# EAGLE design M227X (EAGLE 6.6.0)
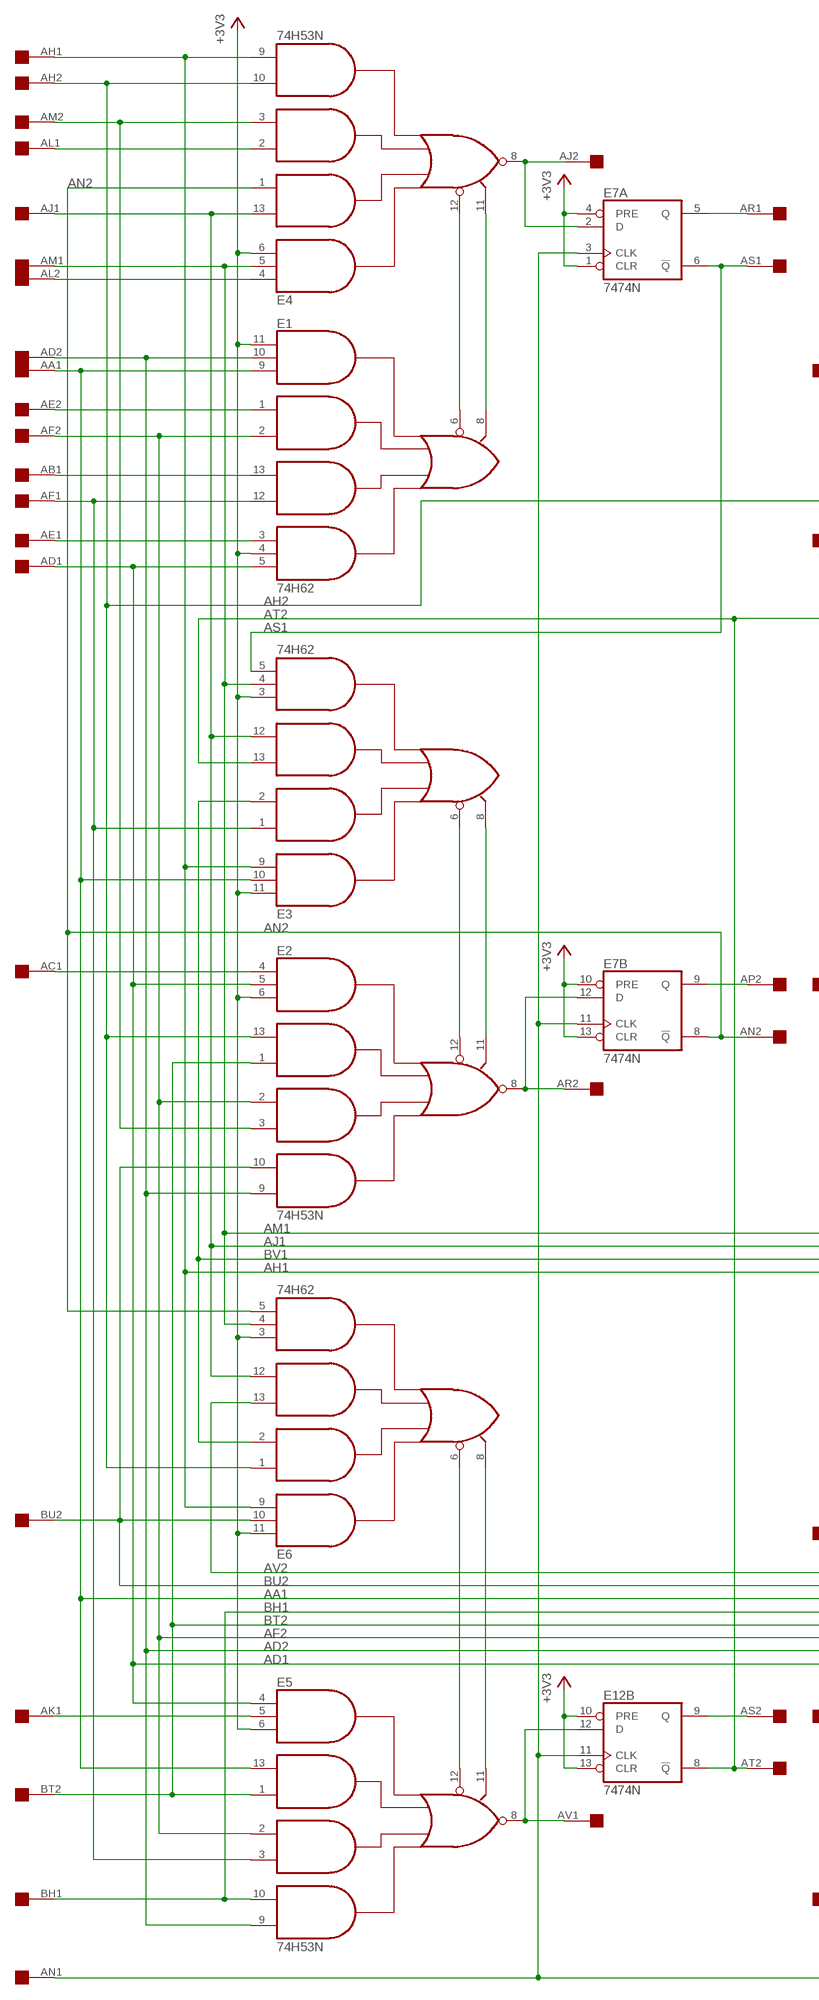
[diagram p0: schematic, sheet 1, part 1 of 2]
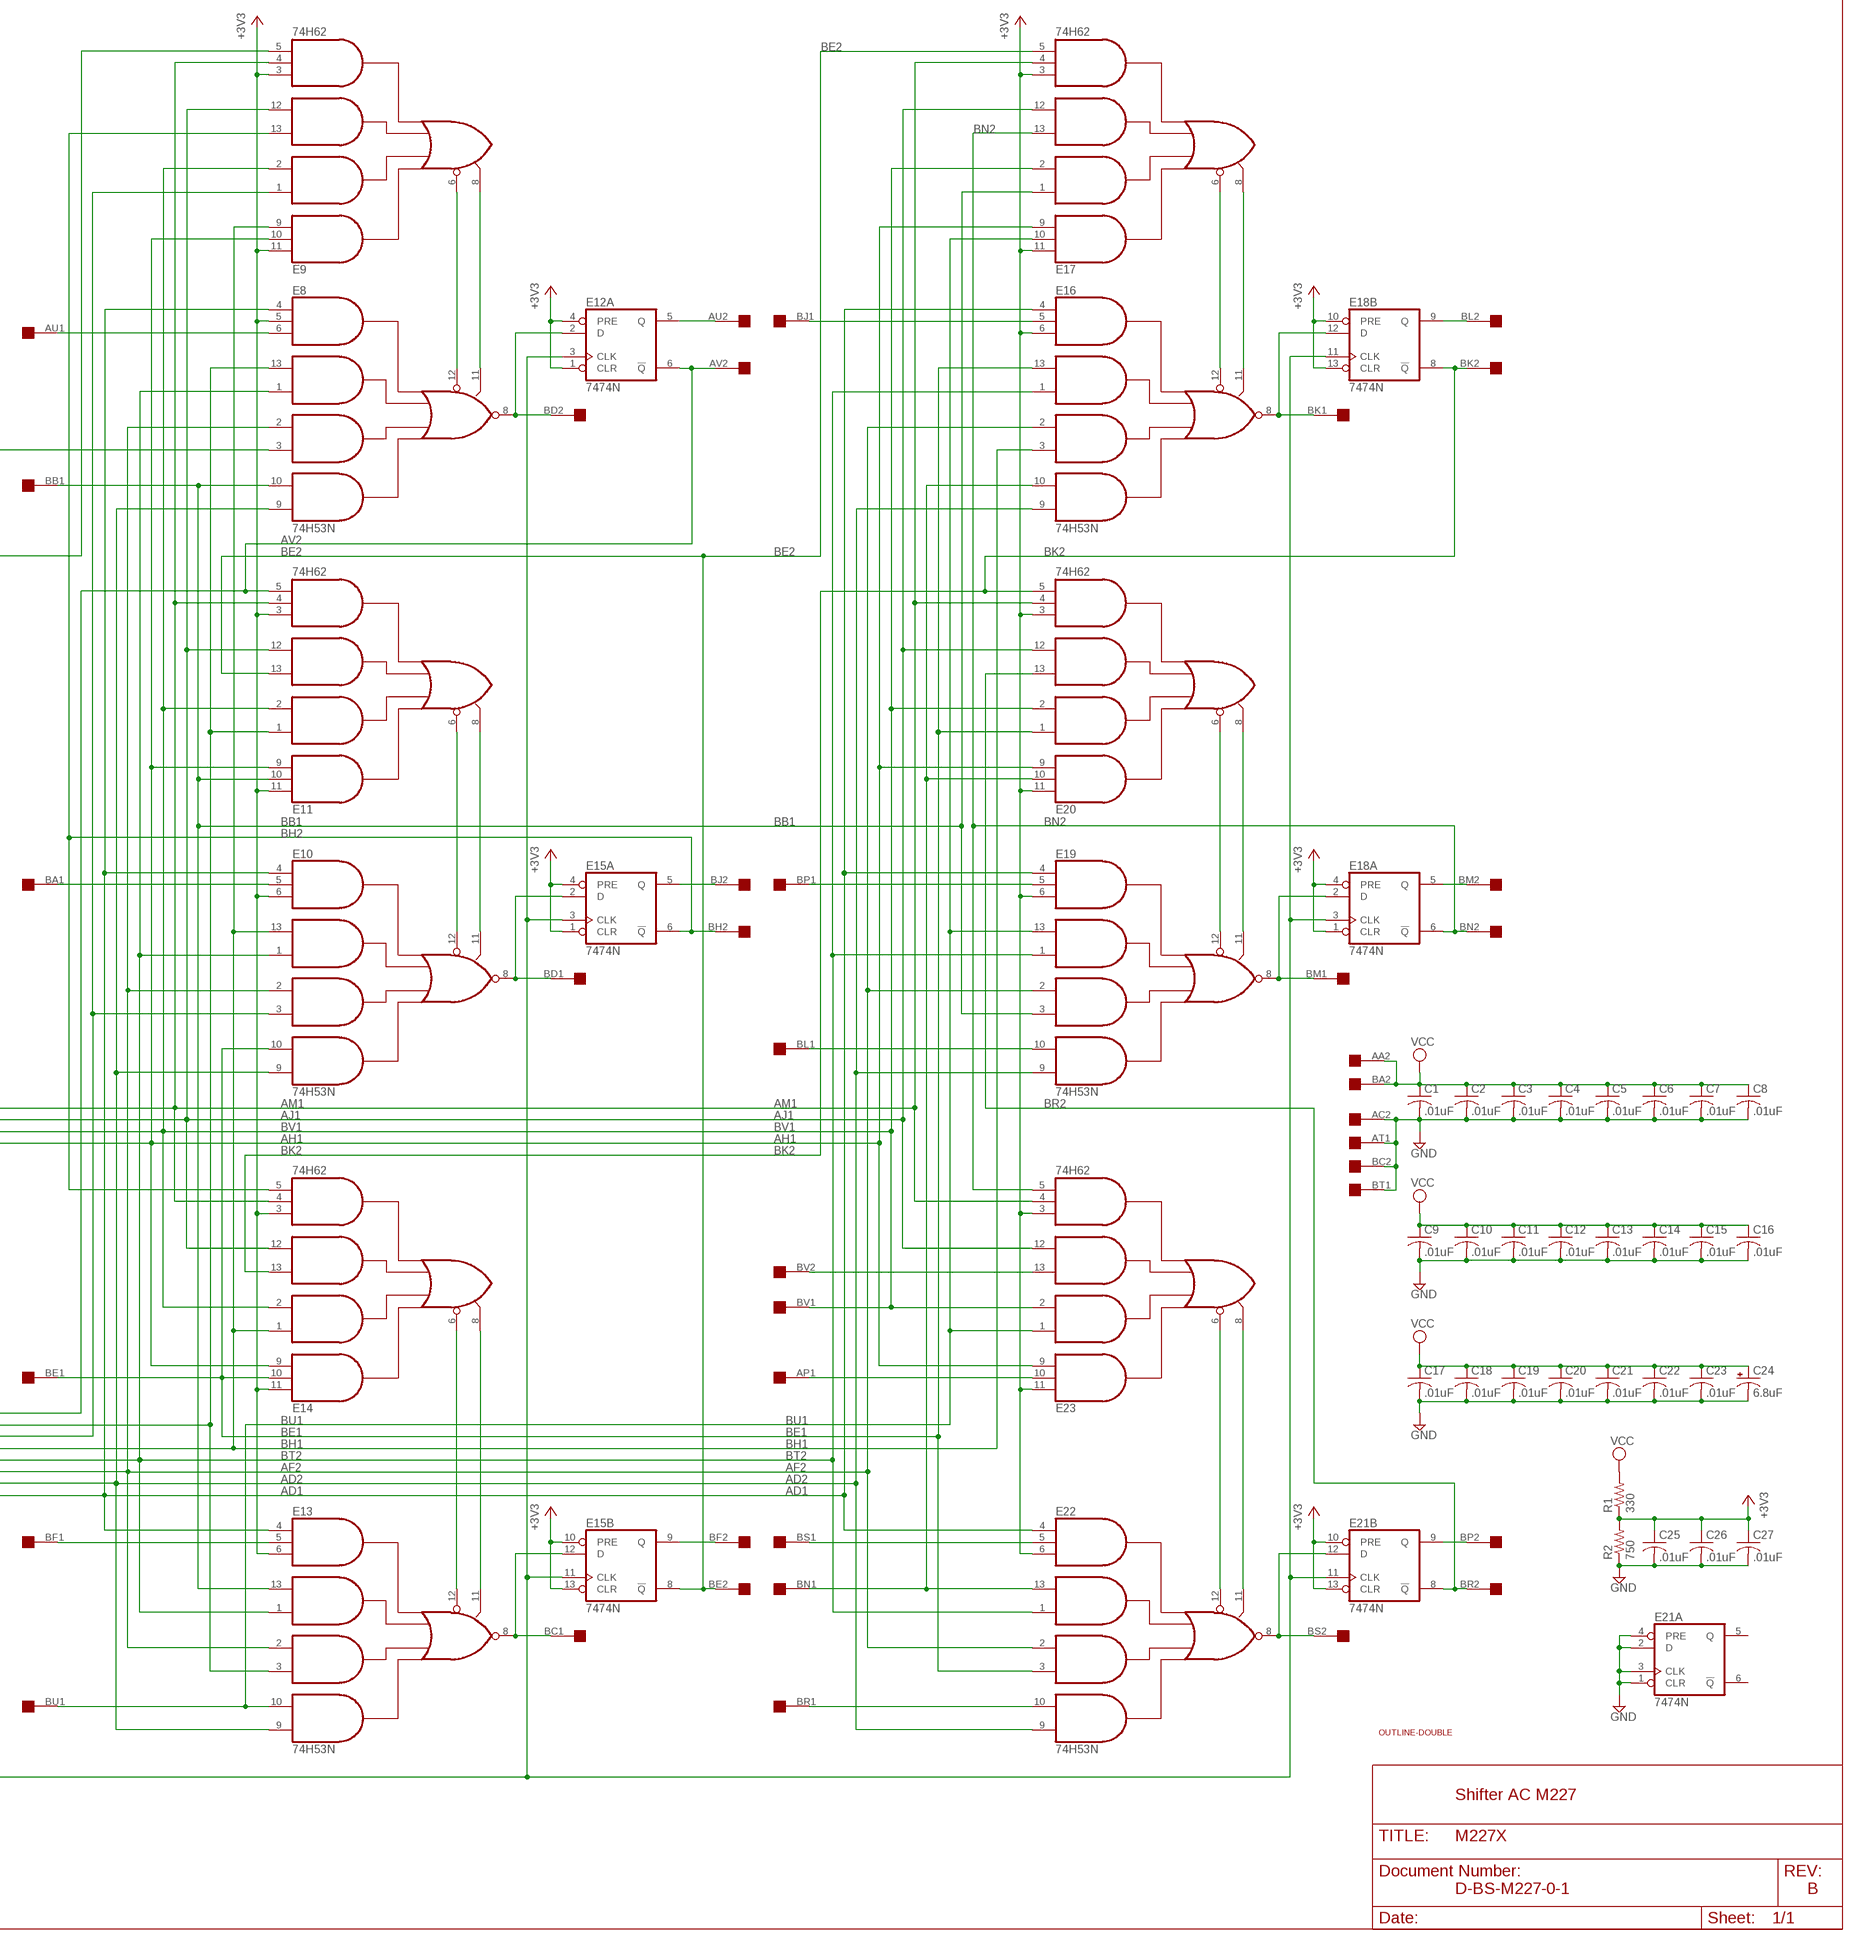
[diagram p1: schematic, sheet 1, part 2 of 2]

## Parts
C1  .01uF  C-US050-025X075  [C050-025X075]
C2  .01uF  C-US050-025X075  [C050-025X075]
C3  .01uF  C-US050-025X075  [C050-025X075]
C4  .01uF  C-US050-025X075  [C050-025X075]
C5  .01uF  C-US050-025X075  [C050-025X075]
C6  .01uF  C-US050-025X075  [C050-025X075]
C7  .01uF  C-US050-025X075  [C050-025X075]
C8  .01uF  C-US050-025X075  [C050-025X075]
C9  .01uF  C-US050-025X075  [C050-025X075]
C10  .01uF  C-US050-025X075  [C050-025X075]
C11  .01uF  C-US050-025X075  [C050-025X075]
C12  .01uF  C-US050-025X075  [C050-025X075]
C13  .01uF  C-US050-025X075  [C050-025X075]
C14  .01uF  C-US050-025X075  [C050-025X075]
C15  .01uF  C-US050-025X075  [C050-025X075]
C16  .01uF  C-US050-025X075  [C050-025X075]
C17  .01uF  C-US050-025X075  [C050-025X075]
C18  .01uF  C-US050-025X075  [C050-025X075]
C19  .01uF  C-US050-025X075  [C050-025X075]
C20  .01uF  C-US050-025X075  [C050-025X075]
C21  .01uF  C-US050-025X075  [C050-025X075]
C22  .01uF  C-US050-025X075  [C050-025X075]
C23  .01uF  C-US050-025X075  [C050-025X075]
C24  6.8uF  CPOL-USE20-8AXIAL  [E12-8]
C25  .01uF  C-US050-025X075  [C050-025X075]
C26  .01uF  C-US050-025X075  [C050-025X075]
C27  .01uF  C-US050-025X075  [C050-025X075]
E1  74H62  7462  [DIL14]
E2  74H53N  [DIL14]
E3  74H62  7462  [DIL14]
E4  74H53N  [DIL14]
E5  74H53N  [DIL14]
E6  74H62  7462  [DIL14]
E7  7474N  74S74N  [DIL14]
E8  74H53N  [DIL14]
E9  74H62  7462  [DIL14]
E10  74H53N  [DIL14]
E11  74H62  7462  [DIL14]
E12  7474N  74S74N  [DIL14]
E13  74H53N  [DIL14]
E14  74H62  7462  [DIL14]
E15  7474N  74S74N  [DIL14]
E16  74H53N  [DIL14]
E17  74H62  7462  [DIL14]
E18  7474N  74S74N  [DIL14]
E19  74H53N  [DIL14]
E20  74H62  7462  [DIL14]
E21  7474N  74S74N  [DIL14]
E22  74H53N  [DIL14]
E23  74H62  7462  [DIL14]
R1  330  R-US_0207/10  [0207/10]
R2  750  R-US_0207/10  [0207/10]
U$1  OUTLINE-DOUBLE  [DOUBLE]
U$3  DOUBLE  [EDGE-CON4]

## Nets
+3V3 [supply]: C25.1 C26.1 C27.1 E1.4(I9) E1.11(I1) E2.6(I2) E3.3(I8) E3.11(I1) E4.6(I2) E5.6(I2) E6.3(I8) E6.11(I1) E7.1(A:CLR) E7.4(A:PRE) E7.10(B:PRE) E7.13(B:CLR) E8.5(I11) E9.3(I8) E9.11(I1) E10.6(I2) E11.3(I8) E11.11(I1) E12.1(A:CLR) E12.4(A:PRE) E12.10(B:PRE) E12.13(B:CLR) E13.6(I2) E14.3(I8) E14.11(I1) E15.1(A:CLR) E15.4(A:PRE) E15.10(B:PRE) E15.13(B:CLR) E16.6(I2) E17.3(I8) E17.11(I1) E18.1(A:CLR) E18.4(A:PRE) E18.10(B:PRE) E18.13(B:CLR) E19.6(I2) E20.3(I8) E20.11(I1) E21.10(B:PRE) E21.13(B:CLR) E22.6(I2) E23.3(I8) E23.11(I1) R1.1 R2.2
AA1: E1.9(I3) E3.10(I2) E5.13(I3) E9.1(I4) E10.3(I6) U$3.AA1
AB1: E1.13(I6) U$3.AB1
AC1: E2.4(I1) U$3.AC1
AD1: E1.5(I10) E2.5(I11) E5.4(I1) E8.4(I1) E10.4(I1) E13.4(I1) E16.4(I1) E19.4(I1) E22.4(I1) U$3.AD1
AD2: E1.10(I2) E2.9(I8) E5.9(I8) E8.9(I8) E10.9(I8) E13.9(I8) E16.9(I8) E19.9(I8) E22.9(I8) U$3.AD2
AE1: E1.3(I8) U$3.AE1
AE2: E1.1(I4) U$3.AE2
AF1: E1.12(I7) E3.1(I4) E5.3(I6) U$3.AF1
AF2: E1.2(I5) E2.2(I5) E5.2(I5) E8.2(I5) E10.2(I5) E13.2(I5) E16.2(I5) E19.2(I5) E22.2(I5) U$3.AF2
AH1: E3.9(I3) E4.9(I8) E6.9(I3) E9.10(I2) E11.9(I3) E14.9(I3) E17.9(I3) E20.9(I3) E23.9(I3) U$3.AH1
AH2: E2.13(I3) E4.10(I7) E6.1(I4) E8.3(I6) U$3.AH2
AJ1: E3.12(I7) E4.13(I3) E6.12(I7) E9.12(I7) E11.12(I7) E14.12(I7) E17.12(I7) E20.12(I7) E23.12(I7) U$3.AJ1
AJ2: E4.8(O) E7.2(A:D) U$3.AJ2
AK1: E5.5(I11) U$3.AK1
AL1: E4.2(I5) U$3.AL1
AL2: E4.4(I1) U$3.AL2
AM1: E3.4(I9) E4.5(I11) E6.4(I9) E9.4(I9) E11.4(I9) E14.4(I9) E17.4(I9) E20.4(I9) E23.4(I9) U$3.AM1
AM2: E2.3(I6) E4.3(I6) U$3.AM2
AN1: E7.3(A:CLK) E7.11(B:CLK) E12.3(A:CLK) E12.11(B:CLK) E15.3(A:CLK) E15.11(B:CLK) E18.3(A:CLK) E18.11(B:CLK) E21.11(B:CLK) U$3.AN1
AN2: E4.1(I4) E6.5(I10) E7.8(B:!Q) U$3.AN2
AP1: E23.10(I2) U$3.AP1
AP2: E7.9(B:Q) U$3.AP2
AR1: E7.5(A:Q) U$3.AR1
AR2: E2.8(O) E7.12(B:D) U$3.AR2
AS1: E3.5(I10) E7.6(A:!Q) U$3.AS1
AS2: E12.9(B:Q) U$3.AS2
AT2: E3.13(I6) E9.5(I10) E12.8(B:!Q) U$3.AT2
AU1: E8.6(I2) U$3.AU1
AU2: E12.5(A:Q) U$3.AU2
AV1: E5.8(O) E12.12(B:D) U$3.AV1
AV2: E6.13(I6) E11.5(I10) E12.6(A:!Q) U$3.AV2
BA1: E10.5(I11) U$3.BA1
BB1: E8.10(I7) E11.10(I2) E13.13(I3) E17.1(I4) E19.3(I6) U$3.BB1
BC1: E13.8(O) E15.12(B:D) U$3.BC1
BD1: E10.8(O) E15.2(A:D) U$3.BD1
BD2: E8.8(O) E12.2(A:D) U$3.BD2
BE1: E10.10(I7) E14.10(I2) E16.13(I3) E20.1(I4) E22.3(I6) U$3.BE1
BE2: E11.13(I6) E15.8(B:!Q) E17.5(I10) U$3.BE2
BF1: E13.5(I11) U$3.BF1
BF2: E15.9(B:Q) U$3.BF2
BH1: E5.10(I7) E9.9(I3) E10.13(I3) E14.1(I4) E16.3(I6) U$3.BH1
BH2: E9.13(I6) E14.5(I10) E15.6(A:!Q) U$3.BH2
BJ1: E16.5(I11) U$3.BJ1
BJ2: E15.5(A:Q) U$3.BJ2
BK1: E16.8(O) E18.12(B:D) U$3.BK1
BK2: E14.13(I6) E18.8(B:!Q) E20.5(I10) U$3.BK2
BL1: E19.10(I7) U$3.BL1
BL2: E18.9(B:Q) U$3.BL2
BM1: E18.2(A:D) E19.8(O) U$3.BM1
BM2: E18.5(A:Q) U$3.BM2
BN1: E16.10(I7) E20.10(I2) E22.13(I3) U$3.BN1
BN2: E17.13(I6) E18.6(A:!Q) E23.5(I10) U$3.BN2
BP1: E19.5(I11) U$3.BP1
BP2: E21.9(B:Q) U$3.BP2
BR1: E22.10(I7) U$3.BR1
BR2: E20.13(I6) E21.8(B:!Q) U$3.BR2
BS1: E22.5(I11) U$3.BS1
BS2: E21.12(B:D) E22.8(O) U$3.BS2
BT2: E2.1(I4) E5.1(I4) E8.1(I4) E10.1(I4) E13.1(I4) E16.1(I4) E19.1(I4) E22.1(I4) U$3.BT2
BU1: E13.10(I7) E17.10(I2) E19.13(I3) E23.1(I4) U$3.BU1
BU2: E2.10(I7) E6.10(I2) E8.13(I3) E11.1(I4) E13.3(I6) U$3.BU2
BV1: E3.2(I5) E6.2(I5) E9.2(I5) E11.2(I5) E14.2(I5) E17.2(I5) E20.2(I5) E23.2(I5) U$3.BV1
BV2: E23.13(I6) U$3.BV2
GND [supply]: C1.2 C2.2 C3.2 C4.2 C5.2 C6.2 C7.2 C8.2 C9.2 C10.2 C11.2 C12.2 C13.2 C14.2 C15.2 C16.2 C17.2 C18.2 C19.2 C20.2 C21.2 C22.2 C23.2 C24.- C25.2 C26.2 C27.2 E21.1(A:CLR) E21.2(A:D) E21.3(A:CLK) E21.4(A:PRE) R2.1 U$3.AC2 U$3.AT1 U$3.BC2 U$3.BT1
N$1: E5.12(I9) E6.6(E0)
N$2: E5.11(I10) E6.8(E1)
N$3: E2.12(I9) E3.6(E0)
N$4: E2.11(I10) E3.8(E1)
N$5: E1.6(E0) E4.12(I9)
N$6: E1.8(E1) E4.11(I10)
N$14: E22.12(I9) E23.6(E0)
N$16: E13.12(I9) E14.6(E0)
N$17: E13.11(I10) E14.8(E1)
N$18: E10.12(I9) E11.6(E0)
N$19: E10.11(I10) E11.8(E1)
N$20: E8.12(I9) E9.6(E0)
N$21: E8.11(I10) E9.8(E1)
N$22: E16.11(I10) E17.8(E1)
N$23: E16.12(I9) E17.6(E0)
N$24: E19.12(I9) E20.6(E0)
N$25: E19.11(I10) E20.8(E1)
N$27: E22.11(I10) E23.8(E1)
VCC [supply]: C1.1 C2.1 C3.1 C4.1 C5.1 C6.1 C7.1 C8.1 C9.1 C10.1 C11.1 C12.1 C13.1 C14.1 C15.1 C16.1 C17.1 C18.1 C19.1 C20.1 C21.1 C22.1 C23.1 C24.+ R1.2 U$3.AA2 U$3.BA2
Unconnected: E21.5(A:Q) E21.6(A:!Q) U$3.AB2 U$3.AK2 U$3.BB2

## Notes on the sheet
- Shifter AC M227
- D-BS-M227-0-1 | B

## Power pins joined to a net without a drawn wire
GND: E1.7(GND) E2.7(GND) E3.7(GND) E4.7(GND) E5.7(GND) E6.7(GND) E7.7(P:GND) E8.7(GND) E9.7(GND) E10.7(GND) E11.7(GND) E12.7(P:GND) E13.7(GND) E14.7(GND) E15.7(P:GND) E16.7(GND) E17.7(GND) E18.7(P:GND) E19.7(GND) E20.7(GND) E21.7(P:GND) E22.7(GND) E23.7(GND)
VCC: E1.14(VCC) E2.14(VCC) E3.14(VCC) E4.14(VCC) E5.14(VCC) E6.14(VCC) E7.14(P:VCC) E8.14(VCC) E9.14(VCC) E10.14(VCC) E11.14(VCC) E12.14(P:VCC) E13.14(VCC) E14.14(VCC) E15.14(P:VCC) E16.14(VCC) E17.14(VCC) E18.14(P:VCC) E19.14(VCC) E20.14(VCC) E21.14(P:VCC) E22.14(VCC) E23.14(VCC)

## Library data of the parts
C1-C23 C25-C27 = rcl:C-US: CAPACITOR, American symbol
C24 = dec-con:CPOL-USE20-8AXIAL: A 0.8 inch electrolytic.
E1 E3 E6 E9 E11 E14 E17 E20 E23 = dec-con:74*62: 3-2-2-3 Gate Expander
E2 E4 E5 E8 E10 E13 E16 E19 E22 = dec-con:74H53N: 2-2-2-3 Input And-Or-Invert Gate
E7 E12 E15 E18 E21 = 74xx-us:74*74: Dual D type positive edge triggered FLIP FLOP, preset and clear
R1 R2 = rcl:R-US_: RESISTOR, American symbol
U$1 = dec-con:OUTLINE-*: Board outlines for DEC boards.
U$3 = dec-con:DOUBLE: Double-Height DEC board

## Net classes
1 supply: width 0.813 mm

## Board
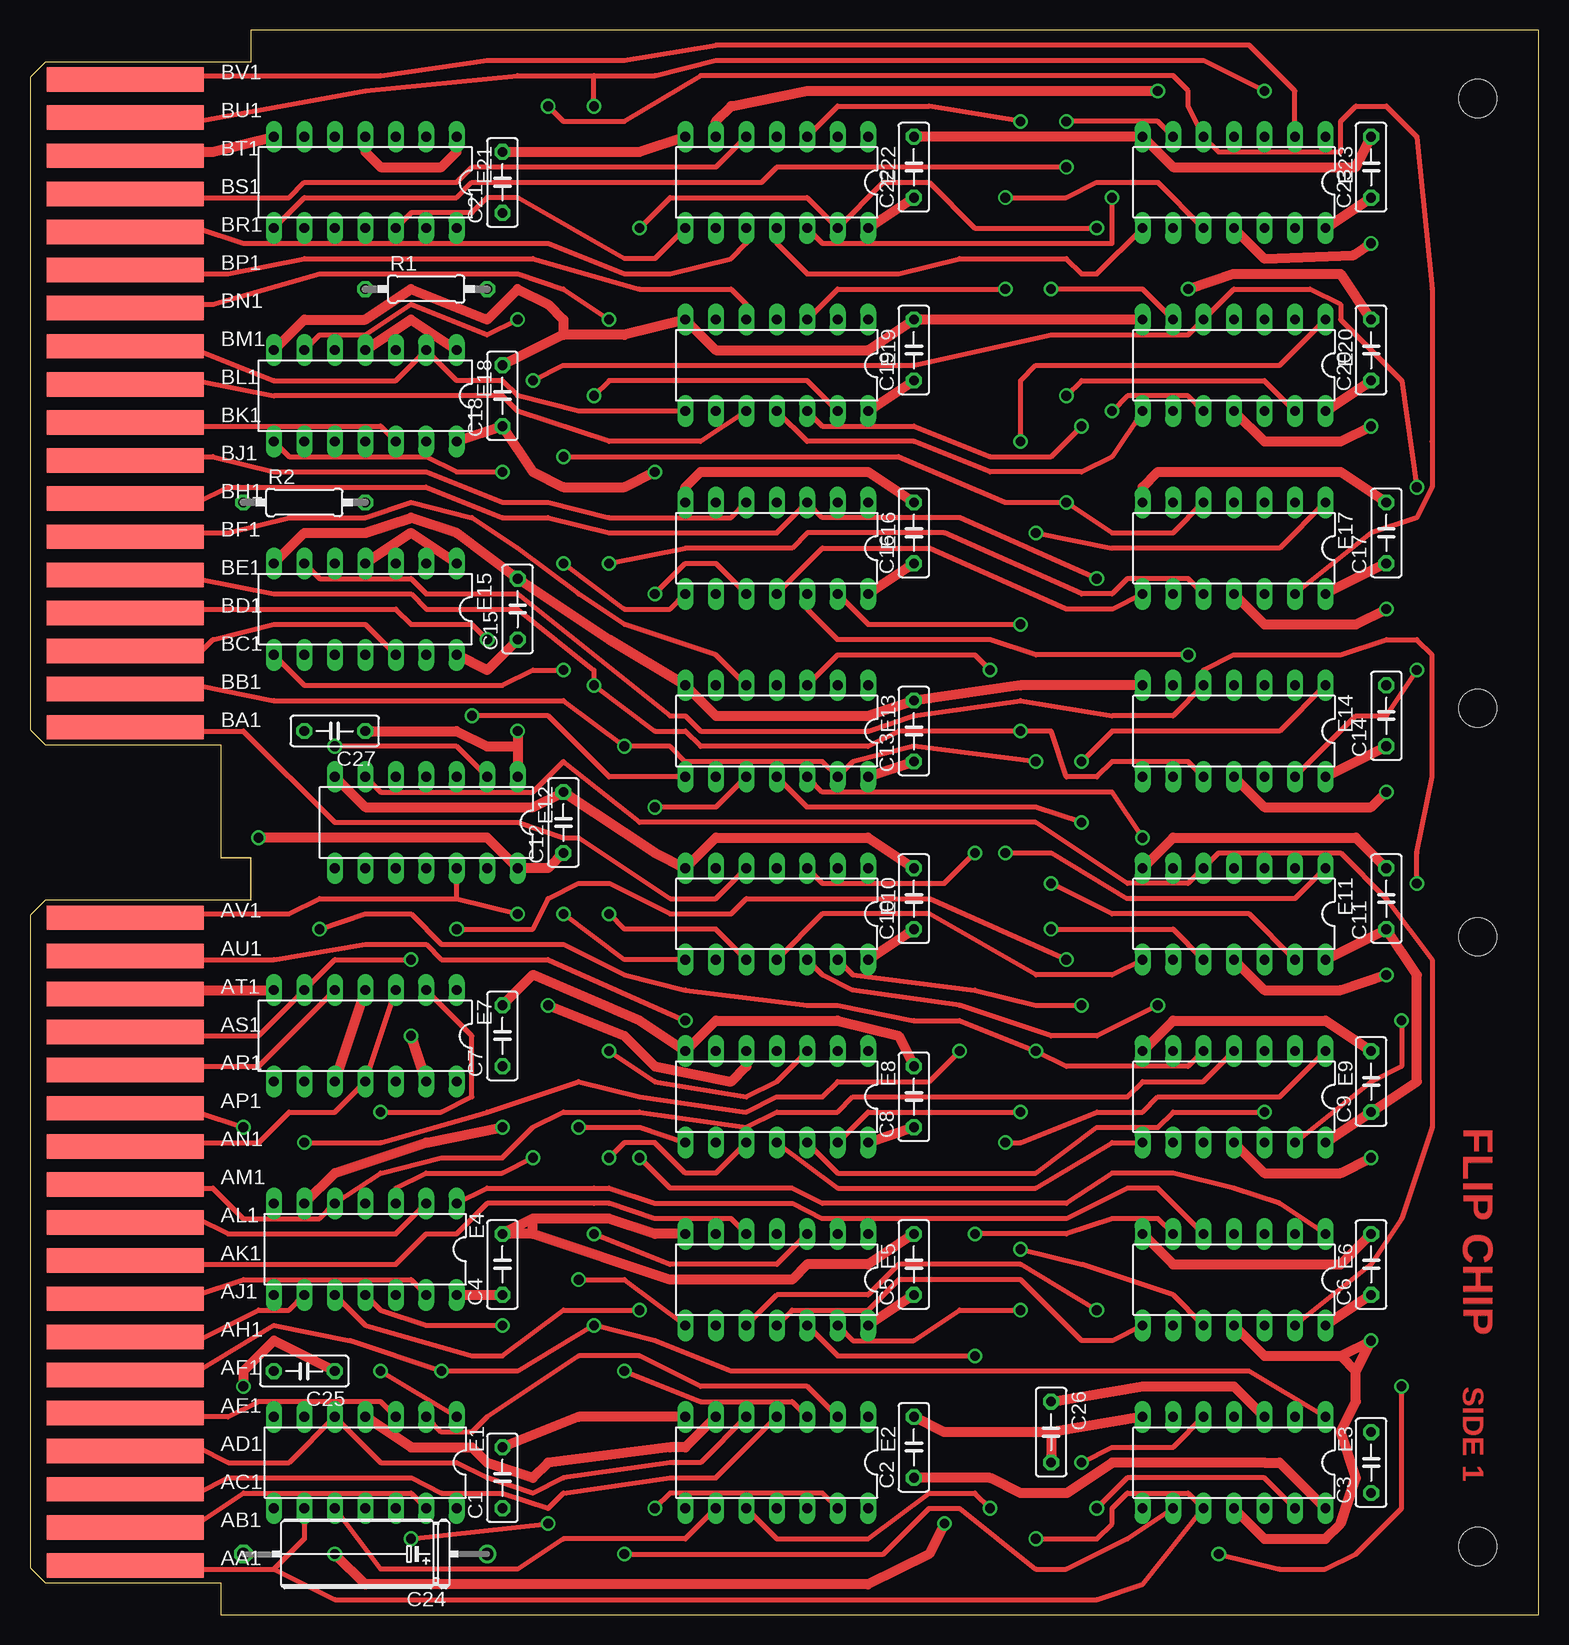
[diagram p2: board, top side]
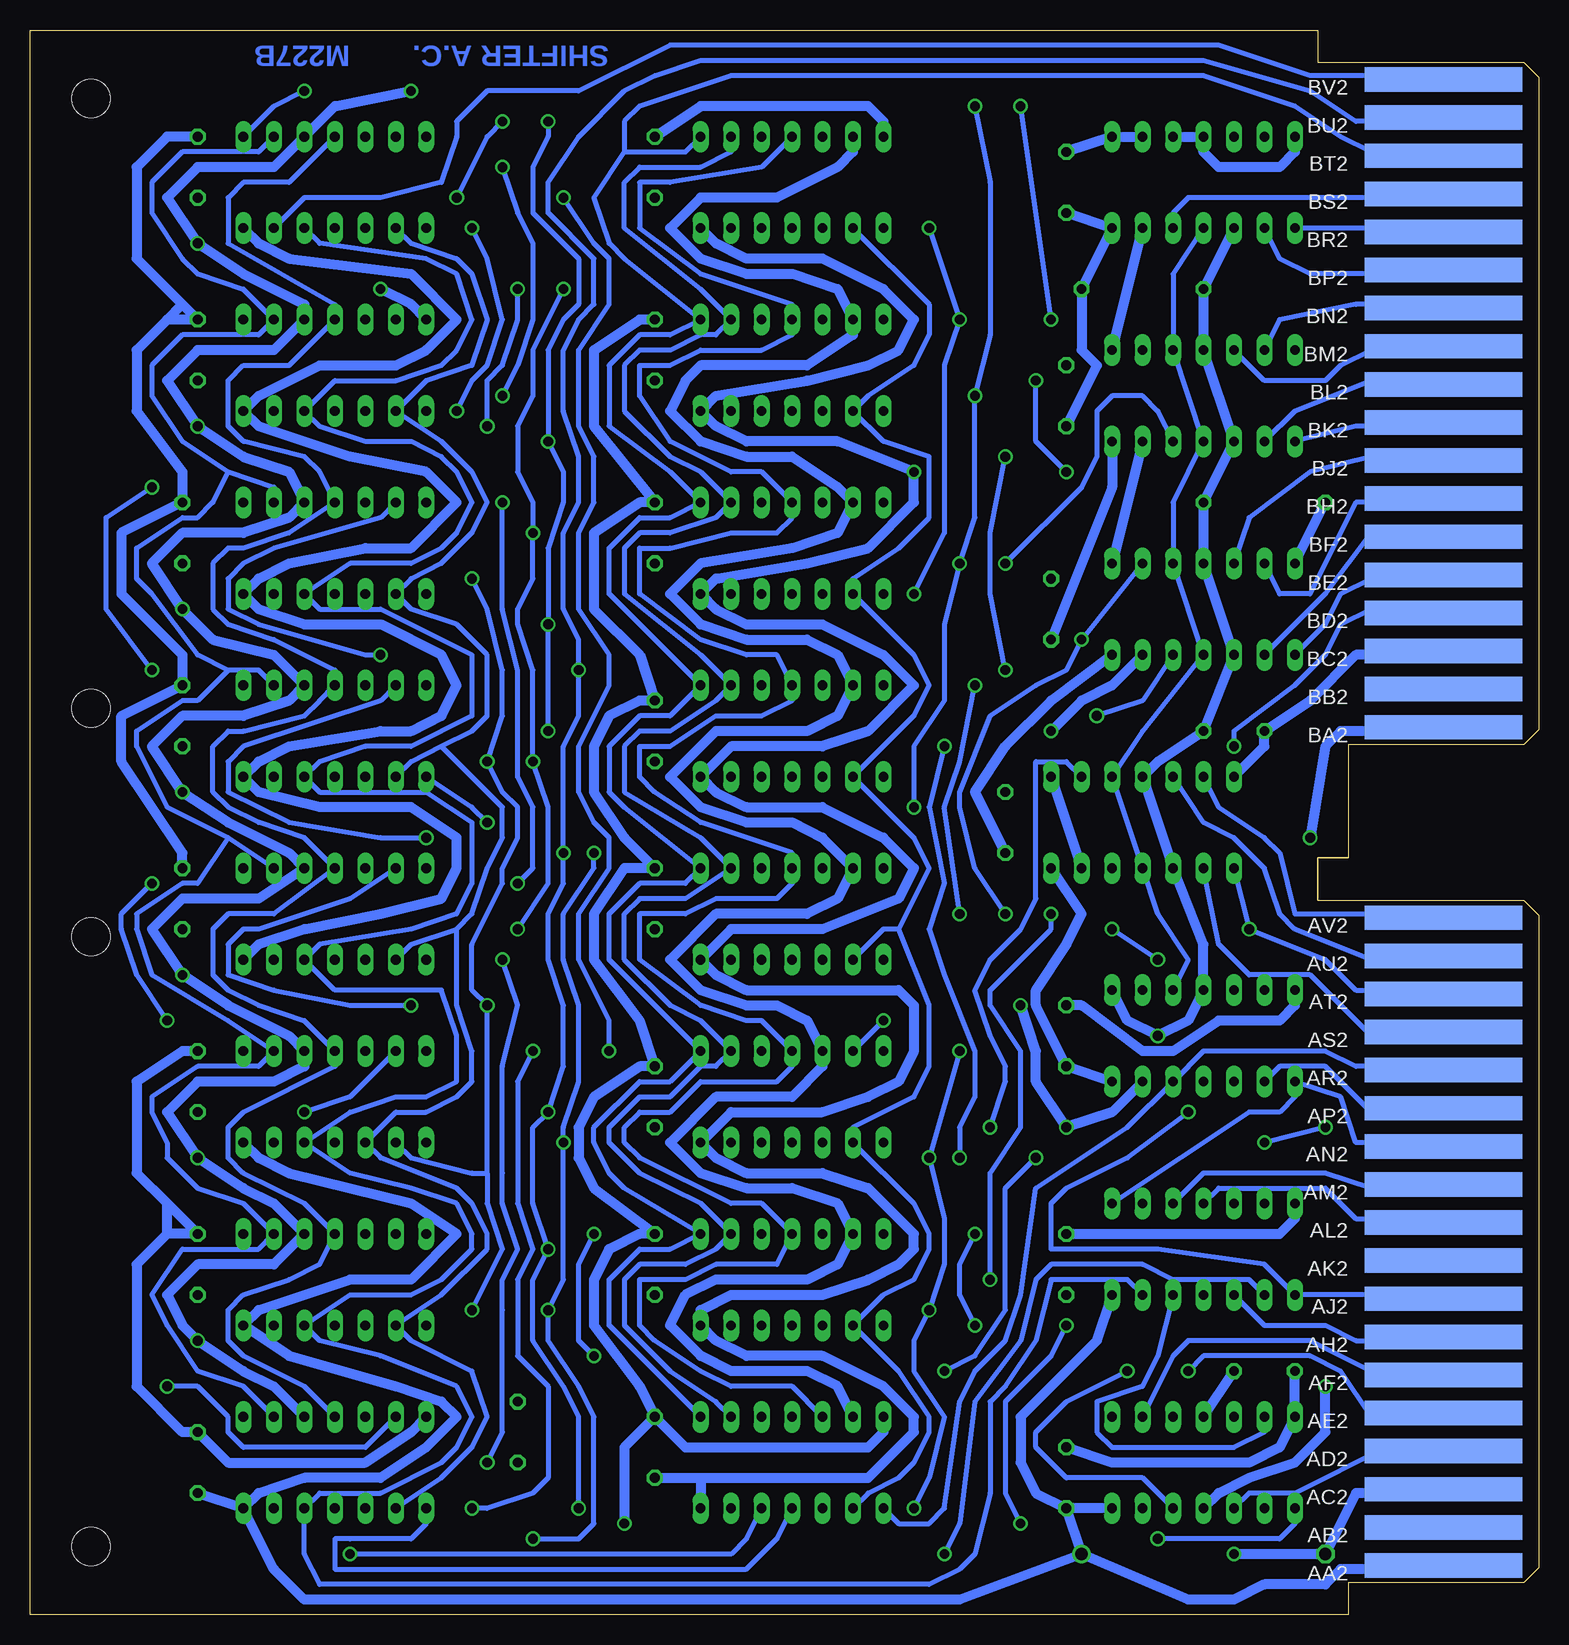
[diagram p3: board, bottom side, seen from below]

Size 125.73 x 132.08 mm. Coordinates in mm from the lower left corner, seen from the top.
Copper layers (1+16): Top 0.035mm / dielectric 1.5mm / Bottom 0.035mm
Design rules "16mils": minimum track width 16mil, minimum drill 32mil, track to track 15mil, track to pad 10mil, pad to pad 10mil, via to via 10mil, smd to smd 10mil, copper to edge 13mil, drill to drill 10mil, minimum pad ring 10mil, minimum via ring 8mil, stop-mask expansion 0mil, vias tented up to drill 0mil, thermal gap 10mil

### Footprints (pad centres in the part's own frame; a part is rotated, then mirrored left to right if it is on the bottom)
C050-025X075 = drill 0.813 octagon: 1 -2.54,0; 2 2.54,0
E12-8 = drill 1.016: + -10.16,0 | drill 1.016 octagon: - 10.16,0
DIL14 = drill 0.813 long: 1 -7.62,-3.81; 2 -5.08,-3.81; 3 -2.54,-3.81; 4 0,-3.81; 5 2.54,-3.81; 6 5.08,-3.81; 7 7.62,-3.81; 8 7.62,3.81; 9 5.08,3.81; 10 2.54,3.81; 11 0,3.81; 12 -2.54,3.81; 13 -5.08,3.81; 14 -7.62,3.81
0207/10 = drill 0.813 octagon: 1 -5.08,0; 2 5.08,0
DOUBLE = hole 3.175: 120.65,56.515; 120.65,5.715; 120.65,75.565; 120.65,126.365
EDGE-CON4 = smd 13.106 x 2.032: AA1 7.938,4.128; AB1 7.938,7.303; AC1 7.938,10.477; AD1 7.938,13.652; AE1 7.938,16.828; AF1 7.938,20.003; AH1 7.938,23.177; AJ1 7.938,26.352; AK1 7.938,29.527; AL1 7.938,32.703; AM1 7.938,35.877; AN1 7.938,39.053; AP1 7.938,42.227; AR1 7.938,45.403; AS1 7.938,48.578; AT1 7.938,51.752; AU1 7.938,54.928; AV1 7.938,58.102; BA1 7.938,73.978; BB1 7.938,77.153; BC1 7.938,80.328; BD1 7.938,83.502; BE1 7.938,86.677; BF1 7.938,89.853; BH1 7.938,93.028; BJ1 7.938,96.203; BK1 7.938,99.377; BL1 7.938,102.552; BM1 7.938,105.728; BN1 7.938,108.903; BP1 7.938,112.078; BR1 7.938,115.252; BS1 7.938,118.427; BT1 7.938,121.603; BU1 7.938,124.778; BV1 7.938,127.953 | smd 13.106 x 2.032 bottom: AA2 7.938,4.128; AB2 7.938,7.303; AC2 7.938,10.477; AD2 7.938,13.652; AE2 7.938,16.828; AF2 7.938,20.003; AH2 7.938,23.177; AJ2 7.938,26.352; AK2 7.938,29.527; AL2 7.938,32.703; AM2 7.938,35.877; AN2 7.938,39.053; AP2 7.938,42.227; AR2 7.938,45.403; AS2 7.938,48.578; AT2 7.938,51.752; AU2 7.938,54.928; AV2 7.938,58.102; BA2 7.938,73.978; BB2 7.938,77.153; BC2 7.938,80.328; BD2 7.938,83.502; BE2 7.938,86.677; BF2 7.938,89.853; BH2 7.938,93.028; BJ2 7.938,96.203; BK2 7.938,99.377; BL2 7.938,102.552; BM2 7.938,105.728; BN2 7.938,108.903; BP2 7.938,112.078; BR2 7.938,115.252; BS2 7.938,118.427; BT2 7.938,121.603; BU2 7.938,124.778; BV2 7.938,127.953

### Placement (x,y rotation side)
C1  39.37,11.43 90 top
C2  73.66,13.97 90 top
C3  111.76,12.7 90 top
C4  39.37,29.21 90 top
C5  73.66,29.21 90 top
C6  111.76,29.21 90 top
C7  39.37,48.26 90 top
C8  73.66,43.18 90 top
C9  111.76,44.45 90 top
C10  73.66,59.69 90 top
C11  113.03,59.69 90 top
C12  44.45,66.04 90 top
C13  73.66,73.66 90 top
C14  113.03,74.93 90 top
C15  40.64,83.82 90 top
C16  73.66,90.17 90 top
C17  113.03,90.17 90 top
C18  39.37,101.6 90 top
C19  73.66,105.41 90 top
C20  111.76,105.41 90 top
C21  39.37,119.38 90 top
C22  73.66,120.65 90 top
C23  111.76,120.65 90 top
C24  27.94,5.08 180 top
C25  22.86,20.32 180 top
C26  85.09,15.24 270 top
C27  25.4,73.66 180 top
E1  27.94,12.7 180 top
E2  62.23,12.7 180 top
E3  100.33,12.7 180 top
E4  27.94,30.48 180 top
E5  62.23,27.94 180 top
E6  100.33,27.94 180 top
E7  27.94,48.26 180 top
E8  62.23,43.18 180 top
E9  100.33,43.18 180 top
E10  62.23,58.42 180 top
E11  100.33,58.42 180 top
E12  33.02,66.04 180 top
E13  62.23,73.66 180 top
E14  100.33,73.66 180 top
E15  27.94,83.82 180 top
E16  62.23,88.9 180 top
E17  100.33,88.9 180 top
E18  27.94,101.6 180 top
E19  62.23,104.14 180 top
E20  100.33,104.14 180 top
E21  27.94,119.38 180 top
E22  62.23,119.38 180 top
E23  100.33,119.38 180 top
R1  33.02,110.49 0 top
R2  22.86,92.71 0 top
U$1  0,0 0 top
U$3  0,0 0 top

### Tracks (layer width: path | path; a pad name or v marks a point on that pad's centre or on a via)
+3V3  (via drill 0.81)
  Top 0.813: E3.11 102.87,6.35 107.95,6.35 109.22,7.62 110.49,11.43 109.22,15.24 110.49,17.78 110.49,20.32 | 110.49,20.32 v111.76,22.86 109.22,21.59 | C25.1 20.32,22.86 17.78,20.32 v17.78,19.05 | E4.6 25.4,36.83 33.02,39.37 v39.37,40.64 | v43.18,50.8 49.53,48.26 52.07,45.72 58.42,44.45 59.69,45.72 E8.5 | v40.64,73.66 40.64,72.39 | 40.64,72.39 E12.1 | C27.1 35.56,73.66 38.1,72.39 40.64,72.39 | E15.4 31.75,90.17 E15.1 | E18.4 31.75,107.95 E18.1 | E22.6 57.15,124.46 58.42,125.73 64.77,127 v93.98,127 | C26.1 92.71,19.05 100.33,19.05 E3.3 | E6.11 102.87,21.59 109.22,21.59 | 109.22,21.59 110.49,20.32 | E9.11 102.87,36.83 109.22,36.83 v111.76,38.1 | E11.11 102.87,52.07 109.22,52.07 v113.03,53.34 | E14.11 102.87,67.31 111.76,67.31 v113.03,68.58 | E20.11 102.87,97.79 109.22,97.79 v111.76,99.06 | E17.11 102.87,82.55 110.49,82.55 v113.03,83.82 | E7.10 E7.4 | E7.13 v31.75,48.26 | E23.11 102.87,113.03 110.3,113.32 v111.76,114.3 | E1.4 31.75,13.97 36.83,13.97 38.1,12.7 41.91,11.43 43.18,12.7 53.34,13.97 54.61,13.97 E2.6
  Bottom 0.813: E1.11 26.67,10.16 24.13,11.43 20.32,12.7 17.78,15.24 v17.78,19.05 | E1.4 C25.1 | E7.1 34.29,49.53 v31.75,48.26 29.21,49.53 E7.4 27.94,55.88 E12.10 E12.4 31.75,71.12 C27.1 E15.10 E15.4 R2.2 E18.10 E18.4 R1.1 E21.10 | E2.6 58.42,19.05 60.96,20.32 67.31,20.32 69.85,21.59 72.39,24.13 71.12,26.67 68.58,27.94 60.96,27.94 58.42,29.21 E5.6 58.42,34.29 62.23,35.56 66.04,35.56 69.85,36.83 72.39,39.37 68.58,43.18 62.23,43.18 59.69,45.72 E8.5 60.96,49.53 63.5,50.8 66.04,50.8 69.85,52.07 72.39,54.61 68.58,58.42 60.96,58.42 58.42,59.69 E10.6 59.69,64.77 62.23,66.04 66.04,66.04 69.85,67.31 72.39,69.85 68.58,73.66 60.96,73.66 58.42,74.93 E13.6 58.42,80.01 60.96,81.28 66.04,81.28 69.85,82.55 72.39,85.09 69.85,87.63 62.23,88.9 58.42,90.17 E16.6 58.42,93.98 62.23,96.52 66.04,96.52 69.85,97.79 72.39,100.33 71.12,102.87 69.85,104.14 60.96,104.14 57.15,106.68 E19.6 58.42,110.49 62.23,111.76 66.04,111.76 69.85,113.03 72.39,115.57 69.85,118.11 63.5,118.11 58.42,120.65 57.15,121.92 E22.6 | E3.3 105.41,19.05 107.95,20.32 v111.76,22.86 113.03,24.13 114.3,26.67 111.76,29.21 105.41,29.21 E6.3 105.41,34.29 107.95,35.56 v111.76,38.1 114.3,41.91 111.76,44.45 105.41,44.45 102.87,45.72 E9.3 104.14,48.26 109.22,50.8 v113.03,53.34 115.57,57.15 113.03,59.69 106.68,59.69 E11.3 104.14,63.5 109.22,66.04 v113.03,68.58 115.57,72.39 113.03,74.93 107.95,74.93 104.14,76.2 E14.3 105.41,80.01 110.49,81.28 v113.03,83.82 115.57,87.63 113.03,90.17 107.95,90.17 104.14,91.44 E17.3 104.14,95.25 107.95,96.52 v111.76,99.06 114.3,102.87 111.76,105.41 105.41,105.41 E20.3 102.87,109.22 107.95,111.76 v111.76,114.3 114.3,118.11 111.76,120.65 105.41,120.65 E23.3 100.33,125.73 v93.98,127
  Bottom 0.813: E7.13 35.56,41.91 v39.37,40.64 41.91,44.45 41.91,46.99 v43.18,50.8 | E12.13 E12.1 | E15.13 35.56,77.47 38.1,76.2 v40.64,73.66 | E18.1 E21.13 | E18.13 E15.1
AA1  (via drill 0.81)
  Top 0.406: U$3.AA1 8.89,3.81 20.32,3.81 | 20.32,3.81 25.4,1.27 88.9,1.27 92.71,2.54 E3.10 96.52,10.16 91.44,10.16 90.17,8.89 90.17,7.62 88.9,6.35 v83.82,6.35 | E1.9 22.86,6.35 20.32,3.81 | E5.13 68.58,22.86 73.66,22.86 77.47,25.4 v82.55,25.4 | v81.28,39.37 82.55,39.37 88.9,41.91 92.71,41.91 93.98,43.18 104.14,43.18 E9.1 | v78.74,63.5 76.2,60.96 66.04,60.96 E10.3
  Bottom 0.406: v83.82,6.35 80.01,6.35 78.74,7.62 78.74,16.51 80.01,19.05 82.55,22.86 v82.55,25.4 81.28,27.94 v81.28,39.37 81.28,40.64 80.01,44.45 80.01,50.8 81.28,54.61 81.28,58.42 78.74,62.23 v78.74,63.5
AB1
  Top 0.406: U$3.AB1 10.16,7.62 13.97,7.62 17.78,10.16 31.75,10.16 E1.13
AC1
  Top 0.406: U$3.AC1 8.89,10.16 13.97,10.16 16.51,11.43 31.75,11.43 34.29,10.16 39.37,10.16 43.18,8.89 44.45,10.16 53.34,11.43 57.15,11.43 E2.4
AD1
  Top 0.406: U$3.AD1 8.89,13.97 13.97,13.97 16.51,12.7 21.59,12.7 E1.5 29.21,12.7 35.56,12.7 38.1,11.43 41.91,10.16 44.45,11.43 53.34,12.7 55.88,12.7 E2.5
  Bottom 0.406: E2.5 62.23,19.05 67.31,19.05 69.85,20.32 73.66,22.86 74.93,24.13 74.93,27.94 71.12,27.94 68.58,29.21 63.5,29.21 E5.4 64.77,34.29 67.31,34.29 74.93,38.1 76.2,39.37 76.2,40.64 74.93,41.91 72.39,41.91 69.85,44.45 63.5,44.45 62.23,45.72 E8.4 64.77,49.53 66.04,49.53 69.85,50.8 74.93,54.61 74.93,58.42 71.12,58.42 68.58,59.69 63.5,59.69 62.23,60.96 E10.4 62.23,63.5 69.85,66.04 73.66,68.58 74.93,69.85 74.93,72.39 72.39,72.39 68.58,74.93 64.77,74.93 62.23,76.2 E13.4 63.5,80.01 66.04,80.01 69.85,81.28 74.93,85.09 74.93,88.9 72.39,88.9 67.31,90.17 63.5,90.17 62.23,91.44 E16.4 64.77,95.25 67.31,95.25 72.39,97.79 74.93,101.6 74.93,104.14 72.39,104.14 69.85,105.41 64.77,105.41 62.23,106.68 E19.4 62.23,109.22 69.85,111.76 74.93,115.57 74.93,119.38 72.39,119.38 64.77,120.65 E22.4
AD2
  Top 0.406: E2.9 54.61,6.35 44.45,6.35 40.64,3.81 29.21,3.81 E1.10
  Bottom 0.406: U$3.AD2 10.16,13.97 12.7,13.97 20.32,10.16 24.13,10.16 E1.10 | E2.9 55.88,10.16 53.34,11.43 52.07,12.7 50.8,15.24 50.8,16.51 53.34,20.32 E5.9 54.61,26.67 52.07,27.94 50.8,30.48 50.8,31.75 52.07,34.29 E8.9 57.15,40.64 52.07,43.18 50.8,45.72 50.8,50.8 53.34,57.15 | E22.9 50.8,109.22 50.8,106.68 52.07,104.14 55.88,101.6 E19.9 54.61,97.79 50.8,96.52 50.8,91.44 53.34,88.9 57.15,86.36 E16.9 52.07,80.01 50.8,77.47 52.07,74.93 E13.9 52.07,64.77 50.8,62.23 53.34,57.15 | 53.34,57.15 54.61,57.15 E10.9
AE1
  Top 0.406: E1.3 29.21,17.78 19.05,17.78 16.51,16.51 8.89,16.51 U$3.AE1
AE2  (via drill 0.81)
  Top 0.406: v29.21,20.32 E1.1
  Bottom 0.406: U$3.AE2 10.16,16.51 13.97,16.51 16.51,20.32 19.05,21.59 27.94,21.59 v29.21,20.32
AF1  (via drill 0.81)
  Top 0.406: E3.1 101.6,20.32 58.42,20.32 52.07,22.86 v46.99,24.13 40.64,20.32 v34.29,20.32 26.67,22.86 20.32,24.13 13.97,20.32 8.89,20.32 U$3.AF1 | v46.99,31.75 53.34,29.21 62.23,29.21 E5.3
  Bottom 0.406: E1.12 33.02,11.43 39.37,11.43 41.91,13.97 41.91,15.24 39.37,17.78 v34.29,20.32 | v46.99,24.13 48.26,26.67 48.26,29.21 v46.99,31.75
AF2
  Top 0.406: E2.2 64.77,19.05 55.88,19.05 50.8,21.59 45.72,21.59 38.1,16.51 36.83,15.24 34.29,15.24 E1.2
  Bottom 0.406: U$3.AF2 10.16,20.32 13.97,20.32 19.05,22.86 29.21,22.86 30.48,21.59 E1.2 | E2.2 68.58,17.78 72.39,20.32 76.2,24.13 76.2,27.94 74.93,29.21 71.12,29.21 68.58,30.48 E5.2 69.85,34.29 74.93,36.83 77.47,39.37 77.47,40.64 74.93,43.18 72.39,43.18 69.85,45.72 68.58,45.72 E8.2 69.85,49.53 72.39,50.8 76.2,54.61 76.2,58.42 74.93,59.69 71.12,59.69 E10.2 69.85,64.77 76.2,68.58 76.2,72.39 74.93,73.66 72.39,73.66 68.58,76.2 E13.2 69.85,80.01 76.2,85.09 76.2,88.9 74.93,90.17 72.39,90.17 68.58,91.44 E16.2 69.85,95.25 72.39,96.52 76.2,100.33 76.2,104.14 74.93,105.41 72.39,105.41 69.85,106.68 68.58,106.68 E19.2 69.85,110.49 76.2,115.57 76.2,119.38 74.93,120.65 69.85,120.65 67.31,121.92 E22.2
AH1  (via drill 0.81)
  Top 0.406: U$3.AH1 8.89,22.86 13.97,22.86 19.05,25.4 21.59,25.4 E4.9 | v49.53,5.08 71.12,5.08 74.93,8.89 77.47,8.89 83.82,3.81 86.36,3.81 91.44,6.35 E3.9
  Bottom 0.406: E4.9 24.13,27.94 30.48,27.94 33.02,29.21 40.64,29.21 41.91,27.94 43.18,22.86 46.99,17.78 48.26,7.62 v49.53,5.08 | E3.9 91.44,11.43 88.9,13.97 87.63,16.51 88.9,20.32 93.98,22.86 E6.9 91.44,26.67 87.63,30.48 87.63,31.75 88.9,34.29 90.17,35.56 96.52,38.1 E9.10 95.25,41.91 92.71,41.91 90.17,43.18 88.9,44.45 88.9,46.99 90.17,50.8 90.17,57.15 | E11.9 93.98,55.88 90.17,57.15 | 90.17,57.15 88.9,58.42 87.63,62.23 86.36,64.77 86.36,67.31 91.44,72.39 | 91.44,72.39 93.98,71.12 E14.9 | 91.44,72.39 88.9,73.66 87.63,74.93 87.63,80.01 90.17,82.55 93.98,83.82 E17.9 93.98,86.36 91.44,87.63 88.9,90.17 87.63,92.71 88.9,95.25 91.44,97.79 E20.9 92.71,102.87 88.9,104.14 87.63,107.95 88.9,111.76 90.17,113.03 93.98,114.3 E23.9
AH2  (via drill 0.81)
  Top 0.406: E4.10 27.94,24.13 36.83,21.59 39.37,21.59 44.45,25.4 v50.8,25.4 | v48.26,46.99 52.07,44.45 59.69,43.18 62.23,44.45 E8.3 | E2.13 66.04,10.16 53.34,10.16 v52.07,8.89 | E6.1 104.14,34.29 100.33,35.56 95.25,36.83 90.17,36.83 86.36,34.29 66.04,34.29 63.5,35.56 53.34,35.56 v50.8,38.1
  Bottom 0.406: E4.10 22.86,24.13 17.78,24.13 15.24,22.86 8.89,22.86 U$3.AH2 | v48.26,46.99 v50.8,38.1 49.53,33.02 49.53,29.21 v50.8,25.4 52.07,22.86 52.07,20.32 49.53,16.51 50.8,11.43 v52.07,8.89
AJ1
  Top 0.406: U$3.AJ1 8.89,26.67 13.97,26.67 17.78,27.94 31.75,27.94 E4.13
  Bottom 0.406: E4.13 34.29,27.94 40.64,27.94 41.91,22.86 44.45,19.05 45.72,17.78 45.72,10.16 46.99,5.08 48.26,3.81 50.8,2.54 101.6,2.54 102.87,5.08 E3.12 101.6,10.16 96.52,10.16 91.44,12.7 90.17,13.97 88.9,16.51 90.17,19.05 96.52,21.59 101.6,22.86 E6.12 99.06,26.67 93.98,26.67 91.44,27.94 88.9,30.48 88.9,31.75 90.17,34.29 93.98,35.56 99.06,36.83 E9.12 99.06,41.91 95.25,43.18 92.71,43.18 90.17,44.45 90.17,48.26 91.44,52.07 100.33,52.07 E11.12 101.6,55.88 93.98,57.15 90.17,58.42 88.9,60.96 88.9,66.04 92.71,68.58 101.6,68.58 E14.12 101.6,71.12 97.79,72.39 93.98,72.39 88.9,74.93 88.9,80.01 96.52,83.82 101.6,83.82 E17.12 99.06,87.63 93.98,87.63 91.44,88.9 90.17,90.17 88.9,92.71 90.17,95.25 91.44,96.52 93.98,97.79 97.79,97.79 101.6,99.06 E20.12 100.33,102.87 95.25,102.87 91.44,104.14 90.17,105.41 88.9,107.95 90.17,111.76 92.71,113.03 101.6,114.3 E23.12
AJ2  (via drill 0.81)
  Top 0.406: v29.21,41.91 34.29,41.91 36.83,43.18 36.83,48.26 E7.2
  Bottom 0.406: U$3.AJ2 10.16,26.67 E4.8 22.86,29.21 31.75,30.48 40.64,30.48 40.64,34.29 39.37,35.56 34.29,38.1 v29.21,41.91
AK1
  Top 0.406: U$3.AK1 8.89,29.21 30.48,29.21 33.02,31.75 35.56,31.75 38.1,34.29 46.99,34.29 48.26,34.29 52.07,33.02 58.42,33.02 E5.5
AL1
  Top 0.406: U$3.AL1 8.89,33.02 13.97,33.02 16.51,31.75 30.48,31.75 E4.2
AL2
  Bottom 0.406: E4.4 26.67,35.56 17.78,35.56 15.24,33.02 8.89,33.02 U$3.AL2
AM1
  Top 0.406: U$3.AM1 10.16,35.56 15.24,35.56 17.78,33.02 24.13,33.02 E4.5 29.21,36.83 34.29,38.1 39.37,38.1 41.91,40.64 44.45,41.91 50.8,41.91 59.69,40.64 62.23,41.91 67.31,41.91 68.58,43.18 91.44,43.18 92.71,44.45 97.79,44.45 E9.4
  Bottom 0.406: E3.4 102.87,19.05 107.95,21.59 109.22,22.86 109.22,25.4 107.95,26.67 104.14,27.94 101.6,29.21 E6.4 102.87,34.29 107.95,36.83 109.22,38.1 109.22,40.64 107.95,41.91 100.33,45.72 E9.4 102.87,49.53 106.68,50.8 109.22,52.07 110.49,53.34 110.49,57.15 109.22,58.42 105.41,58.42 E11.4 102.87,64.77 106.68,66.04 109.22,67.31 110.49,68.58 110.49,72.39 109.22,73.66 107.95,73.66 102.87,74.93 101.6,76.2 E14.4 100.33,78.74 105.41,81.28 109.22,82.55 110.49,83.82 110.49,87.63 109.22,88.9 107.95,88.9 104.14,90.17 E17.4 101.6,95.25 102.87,96.52 107.95,97.79 109.22,99.06 109.22,102.87 107.95,104.14 104.14,104.14 E20.4 100.33,109.22 109.22,114.3 109.22,118.11 107.95,119.38 104.14,119.38 E23.4
AM2  (via drill 0.81)
  Top 0.406: E4.3 30.48,35.56 33.02,36.83 39.37,36.83 v41.91,38.1 | v49.53,20.32 55.88,17.78 63.5,17.78 E2.3
  Bottom 0.406: U$3.AM2 8.89,35.56 13.97,35.56 17.78,36.83 27.94,36.83 E4.3 | v49.53,20.32 46.99,21.59 44.45,25.4 44.45,35.56 v41.91,38.1
AN1
  Top 0.406: U$3.AN1 8.89,39.37 19.05,39.37 21.59,41.91 25.4,41.91 E7.11 E7.3
  Bottom 0.406: E7.3 29.21,54.61 31.75,58.42 E12.11 E12.3 33.02,73.66 E15.11 E15.3 30.48,92.71 E18.11 E18.3 30.48,111.76 E21.11
AN2
  Top 0.406: E4.1 38.1,35.56 46.99,35.56 48.26,35.56 52.07,34.29 63.5,34.29 66.04,33.02 86.36,33.02 91.44,35.56 93.98,35.56 E6.5
  Bottom 0.406: U$3.AN2 8.89,39.37 15.24,39.37 16.51,43.18 E7.8 20.32,43.18 21.59,41.91 24.13,41.91 E4.1
AP1  (via drill 0.81)
  Top 0.406: U$3.AP1 8.89,41.91 13.97,41.91 v17.78,40.64 | v22.86,39.37 29.21,39.37 38.1,41.91 45.72,44.45 50.8,43.18 59.69,41.91 62.23,43.18 66.04,43.18 67.31,44.45 74.93,44.45 v77.47,46.99 | v81.28,118.11 86.36,118.11 88.9,119.38 93.98,119.38 E23.10
  Bottom 0.406: v17.78,40.64 v22.86,39.37 | v77.47,46.99 77.47,49.53 80.01,54.61 80.01,58.42 77.47,62.23 77.47,64.77 78.74,66.04 80.01,68.58 80.01,72.39 77.47,77.47 77.47,80.01 80.01,83.82 80.01,90.17 78.74,92.71 78.74,96.52 80.01,99.06 80.01,105.41 77.47,109.22 77.47,113.03 78.74,114.3 v81.28,118.11
AP2
  Bottom 0.406: U$3.AP2 8.89,41.91 13.97,41.91 17.78,45.72 21.59,45.72 E7.9
AR1
  Top 0.406: U$3.AR1 10.16,45.72 19.05,45.72 E7.5
AR2
  Bottom 0.406: E2.8 53.34,7.62 50.8,7.62 49.53,8.89 48.26,17.78 46.99,20.32 44.45,22.86 43.18,26.67 41.91,35.56 34.29,40.64 E7.12 27.94,46.99 17.78,46.99 15.24,45.72 8.89,45.72 U$3.AR2
AS1  (via drill 0.81)
  Top 0.406: U$3.AS1 8.89,48.26 19.05,48.26 E7.6 25.4,54.61 v31.75,54.61 | v35.56,57.15 41.91,57.15 43.18,59.69 45.72,60.96 48.26,60.96 53.34,58.42 58.42,58.42 59.69,59.69 74.93,59.69 v86.36,54.61 | E3.5 95.25,13.97 90.17,13.97 v87.63,12.7
  Bottom 0.406: v31.75,54.61 v35.56,57.15 | v87.63,12.7 86.36,15.24 86.36,25.4 86.36,27.94 85.09,30.48 86.36,34.29 86.36,36.83 86.36,45.72 85.09,50.8 v86.36,54.61
AS2
  Bottom 0.406: U$3.AS2 10.16,48.26 13.97,48.26 19.05,53.34 24.13,53.34 26.67,55.88 E12.9
AT2  (via drill 0.81)
  Top 0.406: v24.13,57.15 27.94,58.42 31.75,58.42 34.29,55.88 44.45,55.88 49.53,53.34 54.61,52.07 64.77,50.8 67.31,50.8 73.66,49.53 77.47,49.53 v83.82,46.99 86.36,45.72 96.52,45.72 E9.5 | E3.13 102.87,11.43 91.44,11.43 v88.9,8.89
  Bottom 0.406: E12.8 v24.13,57.15 17.78,54.61 15.24,52.07 8.89,52.07 U$3.AT2 | v83.82,46.99 85.09,44.45 85.09,34.29 83.82,30.48 85.09,27.94 85.09,21.59 82.55,19.05 82.55,11.43 83.82,10.16 87.63,8.89 v88.9,8.89
AU1  (via drill 0.81)
  Top 0.406: U$3.AU1 10.16,54.61 20.32,54.61 27.94,55.88 33.02,55.88 34.29,54.61 43.18,54.61 v54.61,49.53
  Bottom 0.406: E8.6 v54.61,49.53
AU2
  Bottom 0.406: U$3.AU2 11.43,54.61 13.97,54.61 20.32,57.15 21.59,58.42 22.86,62.23 25.4,64.77 27.94,66.04 E12.5
AV1  (via drill 0.81)
  Top 0.406: U$3.AV1 8.89,58.42 21.59,58.42 24.13,59.69 35.56,59.69 | 35.56,59.69 E12.12 | 35.56,59.69 v40.64,58.42 | v45.72,27.94 49.53,27.94 E5.8
  Bottom 0.406: v45.72,27.94 45.72,36.83 43.18,40.64 43.18,46.99 45.72,50.8 45.72,52.07 40.64,57.15 v40.64,58.42
AV2
  Top 0.406: E6.13 111.76,29.21 114.3,33.02 116.84,40.64 116.84,54.61 113.03,59.69 109.22,63.5 99.06,63.5 E11.5 96.52,60.96 91.44,60.96 83.82,66.04 50.8,66.04 44.45,71.12 41.91,68.58 29.21,68.58 E12.6
  Bottom 0.406: E12.6 26.67,67.31 22.86,64.77 21.59,63.5 20.32,58.42 8.89,58.42 U$3.AV2
BA1
  Top 0.406: U$3.BA1 8.89,73.66 17.78,73.66 25.4,66.04 40.64,66.04 44.45,64.77 45.72,64.77 53.34,59.69 57.15,59.69 E10.5
BB1  (via drill 0.81)
  Top 0.406: E8.10 57.15,36.83 54.61,36.83 52.07,39.37 49.53,39.37 v48.26,38.1 | U$3.BB1 10.16,77.47 13.97,77.47 20.32,76.2 44.45,76.2 v49.53,72.39 53.34,72.39 54.61,71.12 66.04,71.12 E13.13 68.58,71.12 73.66,72.39 v83.82,71.12 | E11.10 95.25,57.15 v85.09,57.15 | v83.82,90.17 90.17,88.9 104.14,88.9 E17.1 | E19.3 67.31,110.49 v81.28,110.49
  Bottom 0.406: v49.53,72.39 50.8,67.31 49.53,60.96 50.8,57.15 49.53,53.34 46.99,46.99 46.99,43.18 48.26,40.64 v48.26,38.1 | v85.09,57.15 82.55,60.96 82.55,67.31 v83.82,71.12 83.82,78.74 85.09,82.55 85.09,83.82 83.82,86.36 v83.82,90.17 83.82,92.71 85.09,95.25 85.09,99.06 83.82,101.6 83.82,105.41 v81.28,110.49
BC1  (via drill 0.81)
  Top 0.406: E13.8 48.26,69.85 43.18,74.93 v36.83,74.93 | U$3.BC1 8.89,80.01 13.97,80.01 15.24,81.28 20.32,82.55 27.94,82.55 E15.12
  Bottom 0.406: E15.12 33.02,76.2 v36.83,74.93
BD1  (via drill 0.81)
  Top 0.406: E10.8 49.53,54.61 v44.45,58.42 | U$3.BD1 10.16,83.82 30.48,83.82 31.75,82.55 36.83,82.55 v38.1,81.28
  Bottom 0.406: v44.45,58.42 46.99,62.23 48.26,67.31 48.26,68.58 45.72,74.93 41.91,77.47 39.37,78.74 v38.1,81.28 E15.2
BD2  (via drill 0.81)
  Top 0.406: v45.72,40.64 50.8,40.64 E8.8 | E12.2 35.56,72.39 v25.4,72.39
  Bottom 0.406: U$3.BD2 10.16,83.82 13.97,83.82 16.51,82.55 17.78,80.01 20.32,77.47 25.4,73.66 v25.4,72.39 | v45.72,40.64 44.45,44.45 44.45,45.72 45.72,48.26 46.99,52.07 45.72,54.61 43.18,57.15 41.91,59.69 41.91,71.12 39.37,71.12 E12.2
BE1  (via drill 0.81)
  Top 0.406: U$3.BE1 10.16,86.36 13.97,86.36 20.32,85.09 31.75,85.09 33.02,83.82 40.64,83.82 46.99,78.74 v46.99,77.47 52.07,73.66 54.61,73.66 55.88,72.39 69.85,72.39 72.39,73.66 v82.55,73.66 85.09,73.66 86.36,69.85 88.9,69.85 90.17,71.12 96.52,71.12 E14.10 | E22.3 67.31,125.73 74.93,125.73 v82.55,124.46 | E10.10 57.15,57.15 49.53,57.15 v48.26,58.42 | v82.55,97.79 82.55,102.87 83.82,104.14 104.14,104.14 E20.1 | E16.13 69.85,82.55 v82.55,82.55
  Bottom 0.406: v82.55,124.46 82.55,123.19 83.82,120.65 83.82,116.84 80.01,113.03 80.01,109.22 81.28,107.95 82.55,105.41 v82.55,97.79 81.28,95.25 81.28,92.71 82.55,88.9 v82.55,82.55 v82.55,73.66 | v48.26,58.42 49.53,67.31 48.26,71.12 v46.99,77.47
BE2  (via drill 0.81)
  Top 0.406: E15.8 22.86,77.47 39.37,77.47 41.91,78.74 v44.45,78.74 | E11.13 101.6,58.42 90.17,58.42 v85.09,60.96 | E17.5 95.25,90.17 90.17,90.17 v86.36,92.71 81.28,92.71 72.39,96.52 v44.45,96.52
  Bottom 0.406: U$3.BE2 8.89,86.36 13.97,86.36 16.51,85.09 17.78,82.55 E15.8 | v44.45,78.74 45.72,85.09 45.72,90.17 v44.45,96.52 | v85.09,60.96 83.82,62.23 83.82,67.31 85.09,69.85 85.09,78.74 86.36,83.82 v86.36,92.71
BF1
  Top 0.406: U$3.BF1 10.16,90.17 16.51,90.17 21.59,91.44 27.94,91.44 31.75,92.71 36.83,91.44 40.64,88.9 45.72,85.09 49.53,82.55 57.15,80.01 E13.5
BF2
  Bottom 0.406: U$3.BF2 8.89,90.17 13.97,90.17 17.78,85.09 E15.9
BH1  (via drill 0.81)
  Top 0.406: U$3.BH1 8.89,92.71 13.97,92.71 16.51,93.98 33.02,93.98 39.37,91.44 43.18,91.44 48.26,90.17 62.23,90.17 E16.3 66.04,91.44 77.47,91.44 v88.9,86.36 | v88.9,25.4 82.55,29.21 72.39,29.21 69.85,26.67 62.23,26.67 E5.10 | E10.13 68.58,53.34 78.74,52.07 83.82,50.8 v87.63,50.8 | v87.63,71.12 90.17,73.66 104.14,73.66 E14.1
  Bottom 0.406: E9.9 93.98,38.1 88.9,36.83 87.63,36.83 | 87.63,36.83 87.63,34.29 86.36,30.48 v88.9,25.4 | 87.63,36.83 v87.63,50.8 88.9,52.07 88.9,55.88 86.36,60.96 86.36,62.23 85.09,64.77 85.09,67.31 86.36,68.58 v87.63,71.12 86.36,74.93 86.36,78.74 87.63,83.82 v88.9,86.36
BH2  (via drill 0.81)
  Top 0.406: v114.3,49.53 114.3,45.72 111.76,44.45 E9.13 | v115.57,60.96 115.57,63.5 116.84,69.85 116.84,80.01 115.57,81.28 113.03,81.28 109.22,80.01 100.33,80.01 97.79,78.74 E14.5 95.25,74.93 90.17,74.93 82.55,76.2 73.66,74.93 69.85,73.66 55.88,73.66 54.61,74.93 53.34,74.93 40.64,85.09 33.02,85.09 31.75,86.36 24.13,86.36 E15.6
  Bottom 0.406: U$3.BH2 10.16,92.71 15.24,92.71 19.05,85.09 21.59,85.09 E15.6 | v114.3,49.53 116.84,53.34 118.11,57.15 118.11,58.42 v115.57,60.96
BJ1
  Top 0.406: U$3.BJ1 8.89,96.52 15.24,96.52 20.32,95.25 33.02,95.25 39.37,92.71 43.18,92.71 48.26,91.44 58.42,91.44 E16.5
BJ2
  Bottom 0.406: U$3.BJ2 10.16,96.52 13.97,96.52 19.05,95.25 24.13,91.44 E15.5
BK1  (via drill 0.81)
  Top 0.406: v44.45,87.63 49.53,83.82 53.34,83.82 E16.8 | U$3.BK1 10.16,99.06 29.21,99.06 E18.12
  Bottom 0.406: E18.12 31.75,100.33 33.02,101.6 35.56,101.6 36.83,100.33 36.83,96.52 38.1,93.98 v44.45,87.63
BK2  (via drill 0.81)
  Top 0.406: E18.8 21.59,96.52 33.02,96.52 35.56,95.25 v39.37,95.25 | v41.91,102.87 44.45,104.14 73.66,104.14 85.09,106.68 96.52,106.68 E20.5 100.33,110.49 106.68,110.49 109.22,109.22 109.22,107.95 114.3,102.87 v115.57,93.98 | E14.13 110.49,74.93 113.03,74.93 v115.57,78.74
  Bottom 0.406: U$3.BK2 10.16,99.06 15.24,99.06 E18.8 | v39.37,95.25 41.91,97.79 v41.91,102.87 | v115.57,78.74 119.38,83.82 119.38,91.44 v115.57,93.98
BL1
  Top 0.406: U$3.BL1 8.89,102.87 13.97,102.87 20.32,101.6 39.37,101.6 40.64,100.33 48.26,97.79 55.88,97.79 E19.10
BL2
  Bottom 0.406: U$3.BL2 10.16,102.87 13.97,102.87 20.32,100.33 E18.9
BM1
  Top 0.406: U$3.BM1 8.89,105.41 13.97,105.41 20.32,102.87 30.48,102.87 E18.2 35.56,102.87 39.37,102.87 40.64,101.6 45.72,100.33 E19.8
BM2
  Bottom 0.406: U$3.BM2 8.89,105.41 13.97,105.41 16.51,104.14 17.78,102.87 22.86,102.87 E18.5
BN1  (via drill 0.81)
  Top 0.406: U$3.BN1 8.89,109.22 15.24,109.22 24.13,111.76 40.64,111.76 44.45,110.49 v48.26,107.95 | v50.8,115.57 53.34,118.11 64.77,118.11 E22.13 71.12,119.38 74.93,119.38 78.74,115.57 v88.9,115.57 | E20.10 96.52,101.6 91.44,101.6 v90.17,100.33 | v52.07,85.09 54.61,87.63 57.15,87.63 E16.10
  Bottom 0.406: v50.8,115.57 v48.26,107.95 49.53,104.14 49.53,90.17 v52.07,85.09 | v90.17,100.33 88.9,102.87 87.63,104.14 86.36,107.95 87.63,113.03 v88.9,115.57
BN2  (via drill 0.81)
  Top 0.406: E18.6 24.13,106.68 27.94,106.68 31.75,109.22 38.1,106.68 v40.64,107.95 | v43.18,125.73 44.45,124.46 49.53,124.46 55.88,128.27 95.25,128.27 96.52,127 96.52,125.73 E23.5 99.06,121.92 109.22,121.92 109.22,124.46 110.49,125.73 113.03,125.73 115.57,123.19 116.84,110.49 116.84,97.79 116.84,93.98 115.57,91.44 111.76,90.17 E17.13
  Bottom 0.406: U$3.BN2 11.43,109.22 15.24,109.22 21.59,107.95 E18.6 | v40.64,107.95 v43.18,125.73
BP1
  Top 0.406: U$3.BP1 10.16,111.76 16.51,111.76 22.86,113.03 41.91,113.03 50.8,110.49 58.42,110.49 59.69,109.22 E19.5
BP2
  Bottom 0.406: U$3.BP2 10.16,111.76 19.05,111.76 21.59,113.03 E21.9
BR1
  Top 0.406: U$3.BR1 10.16,115.57 13.97,115.57 17.78,114.3 43.18,114.3 49.53,111.76 53.34,111.76 58.42,113.03 59.69,114.3 E22.10
BR2  (via drill 0.81)
  Top 0.406: E21.8 22.86,118.11 35.56,118.11 36.83,119.38 60.96,119.38 62.23,120.65 v86.36,120.65 | v86.36,101.6 87.63,102.87 102.87,102.87 E20.13
  Bottom 0.406: U$3.BR2 10.16,115.57 E21.8 | v86.36,120.65 85.09,116.84 83.82,114.3 83.82,107.95 85.09,104.14 v86.36,101.6
BS1
  Top 0.406: U$3.BS1 8.89,118.11 21.59,118.11 22.86,119.38 35.56,119.38 36.83,120.65 57.15,120.65 E22.5
BS2
  Top 0.406: E22.8 52.07,113.03 49.53,113.03 40.64,118.11 38.1,118.11 36.83,116.84 31.75,116.84 E21.12
  Bottom 0.406: U$3.BS2 8.89,118.11 29.21,118.11 30.48,116.84 E21.12
BT2
  Bottom 0.406: E2.1 77.47,24.13 77.47,27.94 74.93,30.48 72.39,30.48 E5.1 76.2,35.56 77.47,36.83 78.74,39.37 78.74,40.64 74.93,44.45 72.39,44.45 E8.1 77.47,54.61 77.47,58.42 74.93,60.96 71.12,60.96 E10.1 76.2,67.31 77.47,68.58 77.47,72.39 74.93,74.93 72.39,74.93 E13.1 77.47,85.09 77.47,88.9 74.93,91.44 72.39,91.44 E16.1 72.39,95.25 77.47,99.06 77.47,104.14 74.93,106.68 72.39,106.68 E19.1 76.2,113.03 77.47,114.3 78.74,118.11 76.2,121.92 | U$3.BT2 10.16,121.92 13.97,121.92 16.51,123.19 20.32,125.73 27.94,128.27 67.31,128.27 74.93,125.73 76.2,124.46 76.2,121.92 | 76.2,121.92 71.12,121.92 E22.1
BU1  (via drill 0.81)
  Top 0.406: U$3.BU1 8.89,124.46 13.97,124.46 27.94,127 40.64,128.27 46.99,128.27 | 46.99,128.27 52.07,128.27 57.15,129.54 97.79,129.54 v102.87,127 | v48.26,87.63 54.61,88.9 63.5,88.9 64.77,90.17 76.2,90.17 87.63,85.09 90.17,85.09 91.44,86.36 96.52,86.36 E17.10 | v46.99,125.73 46.99,128.27 | E13.10 57.15,67.31 v52.07,67.31 | v46.99,101.6 48.26,102.87 64.77,102.87 E19.13
  Bottom 0.406: E23.1 105.41,125.73 v102.87,127 | v46.99,125.73 45.72,119.38 45.72,106.68 v46.99,101.6 46.99,91.44 v48.26,87.63 49.53,82.55 49.53,76.2 52.07,72.39 v52.07,67.31
BU2  (via drill 0.81)
  Top 0.406: E2.10 62.23,6.35 69.85,6.35 74.93,10.16 78.74,10.16 v80.01,8.89 | v82.55,30.48 87.63,29.21 95.25,26.67 E6.10 | E8.13 69.85,41.91 v82.55,41.91 | v81.28,63.5 85.09,63.5 91.44,59.69 105.41,59.69 E11.1 | E13.3 67.31,80.01 78.74,80.01 v80.01,78.74
  Bottom 0.406: v80.01,8.89 80.01,16.51 81.28,19.05 83.82,22.86 83.82,27.94 v82.55,30.48 83.82,34.29 83.82,40.64 v82.55,41.91 81.28,45.72 81.28,50.8 82.55,54.61 82.55,58.42 81.28,60.96 v81.28,63.5 81.28,72.39 80.01,74.93 v80.01,78.74 80.01,81.28 81.28,83.82 81.28,90.17 80.01,92.71 80.01,96.52 81.28,100.33 81.28,105.41 80.01,107.95 78.74,109.22 78.74,113.03 82.55,116.84 82.55,119.38 80.01,123.19 76.2,127 73.66,128.27 69.85,129.54 27.94,129.54 19.05,127 15.24,124.46 8.89,124.46 U$3.BU2
BV1
  Top 0.406: U$3.BV1 8.89,128.27 29.21,128.27 38.1,129.54 49.53,129.54 57.15,130.81 101.6,130.81 105.41,127 E23.2
  Bottom 0.406: E3.2 107.95,19.05 111.76,20.32 114.3,24.13 115.57,26.67 113.03,30.48 106.68,30.48 E6.2 107.95,34.29 111.76,35.56 114.3,38.1 114.3,39.37 115.57,41.91 115.57,43.18 111.76,45.72 106.68,45.72 E9.2 109.22,49.53 115.57,53.34 116.84,57.15 116.84,58.42 113.03,60.96 111.76,60.96 109.22,64.77 | E23.2 106.68,121.92 113.03,121.92 115.57,119.38 115.57,116.84 113.03,113.03 111.76,111.76 107.95,110.49 E20.2 106.68,106.68 113.03,106.68 115.57,104.14 115.57,101.6 113.03,97.79 109.22,95.25 | E14.2 106.68,78.74 109.22,78.74 | 109.22,78.74 111.76,76.2 113.03,76.2 116.84,73.66 116.84,72.39 114.3,67.31 109.22,64.77 | 109.22,78.74 111.76,80.01 115.57,85.09 116.84,86.36 116.84,88.9 113.03,91.44 111.76,91.44 110.49,92.71 109.22,95.25 | 109.22,95.25 105.41,93.98 E17.2 | E11.2 109.22,64.77
BV2
  Bottom 0.406: U$3.BV2 11.43,128.27 19.05,128.27 26.67,130.81 72.39,130.81 80.01,127 87.63,127 90.17,124.46 90.17,123.19 91.44,119.38 96.52,118.11 102.87,118.11 E23.13
GND  (via drill 0.81)
  Top 0.813: v76.2,7.62 74.93,5.08 69.85,2.54 27.94,2.54 v25.4,5.08 | E2.7 45.72,16.51 C1.2 | U$3.AT1 10.16,52.07 E7.7 | C7.2 41.91,53.34 50.8,49.53 E8.7 57.15,49.53 67.31,49.53 72.39,48.26 C8.2 | E15.7 22.86,90.17 27.94,90.17 31.75,91.44 35.56,90.17 C15.2 48.26,81.28 E13.7 57.15,74.93 69.85,74.93 C13.2 82.55,77.47 E14.7 | E18.7 22.86,107.95 27.94,107.95 31.75,110.49 38.1,107.95 40.64,110.49 43.18,109.22 44.45,107.95 44.45,106.68 | 44.45,106.68 C18.2 | 44.45,106.68 49.53,106.68 E19.7 57.15,105.41 69.85,105.41 C19.2 E20.7 | U$3.BT1 8.89,121.92 15.24,121.92 E21.7 | E3.7 85.09,15.24 | 85.09,15.24 C26.2 | 85.09,15.24 76.2,15.24 C2.2 | E6.7 95.25,29.21 109.22,29.21 C6.2 | E5.7 52.07,31.75 48.26,33.02 41.91,33.02 | 41.91,33.02 C4.2 41.91,31.75 | C5.2 69.85,29.21 64.77,29.21 63.5,27.94 53.34,27.94 41.91,31.75 | 41.91,31.75 41.91,33.02 | E9.7 95.25,49.53 107.95,49.53 C9.2 | C10.2 69.85,64.77 57.15,64.77 E10.7 52.07,63.5 C12.2 41.91,67.31 27.94,67.31 E12.7 | E11.7 95.25,64.77 110.49,64.77 C11.2 | v96.52,110.49 100.33,111.76 109.22,111.76 C20.2 | E17.7 92.71,93.98 93.98,95.25 109.22,95.25 C17.2 | E16.7 54.61,93.98 55.88,95.25 69.85,95.25 C16.2 | E21.4 27.94,121.92 29.21,120.65 34.29,120.65 35.56,121.92 E21.1 | C21.2 50.8,121.92 E22.7 | C22.2 E23.7 95.25,120.65 110.49,120.65 C23.2
  Bottom 0.813: U$3.AC2 10.16,10.16 15.24,10.16 C24.- v25.4,5.08 | C25.2 E1.7 21.59,13.97 24.13,12.7 35.56,12.7 C1.2 | C4.2 21.59,31.75 20.32,33.02 E4.7 | E7.7 20.32,50.8 21.59,49.53 26.67,49.53 30.48,46.99 33.02,46.99 38.1,50.8 C7.2 | U$3.BC2 10.16,80.01 15.24,80.01 19.05,76.2 C27.2 22.86,72.39 E12.7 | C2.2 71.12,13.97 55.88,13.97 54.61,15.24 E2.7 | C2.2 74.93,19.05 78.74,24.13 78.74,27.94 77.47,30.48 74.93,31.75 C5.2 78.74,35.56 80.01,38.1 80.01,40.64 78.74,43.18 74.93,45.72 C8.2 74.93,49.53 78.74,54.61 78.74,58.42 76.2,62.23 C10.2 76.2,64.77 78.74,68.58 78.74,72.39 77.47,74.93 74.93,76.2 C13.2 74.93,80.01 78.74,83.82 78.74,90.17 74.93,92.71 C16.2 78.74,99.06 78.74,105.41 74.93,107.95 C19.2 | C2.2 76.2,13.97 v76.2,7.62 | E3.7 93.98,15.24 97.79,12.7 109.22,12.7 C3.2 113.03,15.24 116.84,19.05 116.84,29.21 114.3,31.75 | 114.3,31.75 C6.2 114.3,34.29 | C9.2 113.03,46.99 116.84,44.45 116.84,36.83 114.3,34.29 | 114.3,31.75 114.3,34.29 | E22.7 54.61,124.46 55.88,125.73 69.85,125.73 C22.2 | C23.2 114.3,123.19 116.84,120.65 116.84,113.03 113.03,109.22 | 113.03,109.22 C20.2 114.3,107.95 | 114.3,107.95 116.84,105.41 116.84,100.33 113.03,95.25 C17.2 118.11,90.17 118.11,85.09 113.03,80.01 C14.2 118.11,74.93 118.11,71.12 113.03,63.5 C11.2 | 114.3,107.95 113.03,109.22 | E20.7 93.98,109.22 v96.52,110.49 | E15.7 R2.1 | E21.7 20.32,121.92 21.59,120.65 26.67,120.65 27.94,121.92 E21.4 E21.3 | C21.2 E21.1 E21.2
N$1  (via drill 0.81)
  Top 0.406: E5.12 67.31,21.59 v78.74,21.59 | E6.6 93.98,33.02 90.17,33.02 86.36,31.75 v78.74,31.75
  Bottom 0.406: v78.74,21.59 80.01,22.86 80.01,29.21 v78.74,31.75
N$2
  Top 0.406: E6.8 90.17,22.86 87.63,22.86 82.55,27.94 72.39,27.94 69.85,25.4 63.5,25.4 E5.11
N$3  (via drill 0.81)
  Top 0.406: v99.06,5.08 104.14,3.81 107.95,3.81 110.49,5.08 114.3,8.89 v114.3,19.05
  Bottom 0.406: E2.12 66.04,6.35 67.31,5.08 v99.06,5.08 | E3.6 97.79,13.97 107.95,13.97 109.22,15.24 109.22,16.51 111.76,19.05 v114.3,19.05
N$4
  Bottom 0.406: E3.8 92.71,7.62 93.98,6.35 99.06,6.35 100.33,6.35 100.33,5.08 100.33,3.81 66.04,3.81 63.5,6.35 E2.11
N$5
  Bottom 0.406: E4.12 31.75,21.59 33.02,19.05 36.83,17.78 36.83,15.24 35.56,13.97 25.4,13.97 22.86,15.24 E1.6
N$6  (via drill 0.81)
  Top 0.406: E4.11 29.21,25.4 33.02,24.13 v39.37,24.13 | v31.75,6.35 v43.18,7.62
  Bottom 0.406: E1.8 20.32,7.62 21.59,6.35 v31.75,6.35 | v39.37,24.13 40.64,21.59 44.45,17.78 44.45,10.16 v43.18,7.62
N$14  (via drill 0.81)
  Top 0.406: E23.6 93.98,124.46 v86.36,124.46 | E22.12 66.04,114.3 90.17,114.3 v90.17,118.11
  Bottom 0.406: v86.36,124.46 87.63,123.19 v90.17,118.11
N$16  (via drill 0.81)
  Top 0.406: v92.71,64.77 90.17,68.58 66.04,68.58 E13.12
  Bottom 0.406: E14.6 96.52,76.2 107.95,72.39 109.22,71.12 109.22,68.58 104.14,66.04 96.52,64.77 v92.71,64.77
N$17  (via drill 0.81)
  Top 0.406: E13.11 64.77,67.31 83.82,67.31 v87.63,66.04
  Bottom 0.406: E14.8 88.9,67.31 v87.63,66.04
N$18  (via drill 0.81)
  Top 0.406: v93.98,50.8 88.9,48.26 85.09,48.26 77.47,50.8 68.58,52.07 66.04,53.34 E10.12
  Bottom 0.406: E11.6 99.06,59.69 106.68,57.15 107.95,57.15 109.22,55.88 109.22,53.34 105.41,52.07 99.06,50.8 v93.98,50.8
N$19
  Top 0.406: E11.8 90.17,53.34 83.82,53.34 74.93,58.42 66.04,58.42 E10.11
N$20  (via drill 0.81)
  Top 0.406: E8.12 67.31,36.83 83.82,36.83 88.9,40.64 93.98,40.64 95.25,41.91 v102.87,41.91
  Bottom 0.406: E9.6 99.06,43.18 v102.87,41.91
N$21
  Top 0.406: E8.11 67.31,35.56 83.82,35.56 90.17,39.37 E9.8
N$22
  Top 0.406: E17.8 90.17,83.82 86.36,83.82 74.93,88.9 66.04,88.9 E16.11
N$23  (via drill 0.81)
  Top 0.406: v96.52,80.01 83.82,80.01 80.01,81.28 67.31,81.28 64.77,83.82 E16.12
  Bottom 0.406: E17.6 96.52,91.44 105.41,88.9 107.95,87.63 109.22,86.36 109.22,83.82 106.68,82.55 97.79,80.01 v96.52,80.01
N$24  (via drill 0.81)
  Top 0.406: E19.12 66.04,99.06 73.66,99.06 80.01,96.52 85.09,96.52 v87.63,99.06 | E20.6 92.71,110.49 v85.09,110.49
  Bottom 0.406: v87.63,99.06 87.63,102.87 86.36,104.14 85.09,107.95 v85.09,110.49
N$25
  Top 0.406: E19.11 64.77,97.79 73.66,97.79 80.01,95.25 87.63,95.25 90.17,96.52 E20.8
N$27
  Top 0.406: E22.11 62.23,114.3 64.77,111.76 72.39,111.76 77.47,113.03 86.36,113.03 87.63,111.76 88.9,111.76 E23.8
VCC  (via drill 0.81)
  Top 0.813: E4.14 C4.1 | v19.05,64.77 38.1,64.77 E12.14 43.18,62.23 C12.1 | C15.1 38.1,78.74 E15.14 | v52.07,95.25 49.53,93.98 44.45,93.98 41.91,95.25 C18.1 E18.14 | E6.14 C6.1 | C5.1 E5.14 | E8.14 C8.1 | E10.14 C10.1 | E13.14 C13.1 | E16.14 C16.1 | E19.14 C19.1 | E22.14 C22.1 | E9.14 C9.1 115.57,44.45 115.57,53.34 C11.1 E11.14 | E14.14 C14.1 | C17.1 E17.14 | C20.1 E20.14 | C23.1 E23.14 | C2.1 80.01,11.43 82.55,10.16 86.36,10.16 90.17,12.7 102.87,12.7 104.14,12.7 105.41,11.43 E3.14
  Bottom 0.813: U$3.AA2 10.16,4.13 10.16,3.81 16.51,3.81 17.78,2.54 22.86,2.54 25.4,1.27 29.21,1.27 C24.+ | C24.+ 48.26,1.27 102.87,1.27 105.41,3.81 E3.14 | E1.14 C1.1 | C24.+ C1.1 | E4.14 36.83,22.86 43.18,16.51 43.18,12.7 41.91,10.16 C1.1 | U$3.BA2 10.16,73.66 16.51,73.66 17.78,72.39 v19.05,64.77 | C18.1 36.83,104.14 38.1,105.41 R1.2 E21.14 C21.1 | C2.1 69.85,11.43 | 69.85,11.43 E2.14 | 69.85,11.43 55.88,11.43 52.07,15.24 52.07,16.51 54.61,19.05 59.69,21.59 66.04,21.59 68.58,22.86 E5.14 69.85,25.4 67.31,26.67 59.69,26.67 55.88,27.94 53.34,29.21 52.07,30.48 52.07,31.75 55.88,35.56 59.69,36.83 66.04,36.83 68.58,38.1 E8.14 67.31,41.91 59.69,41.91 55.88,43.18 53.34,44.45 52.07,46.99 52.07,50.8 53.34,52.07 66.04,52.07 68.58,53.34 E10.14 67.31,57.15 59.69,57.15 53.34,59.69 52.07,62.23 54.61,64.77 59.69,67.31 66.04,67.31 68.58,68.58 E13.14 67.31,72.39 59.69,72.39 55.88,73.66 52.07,77.47 54.61,80.01 59.69,82.55 66.04,82.55 68.58,83.82 E16.14 68.58,86.36 60.96,87.63 55.88,88.9 52.07,92.71 v52.07,95.25 58.42,97.79 66.04,97.79 68.58,99.06 E19.14 68.58,101.6 60.96,102.87 55.88,104.14 53.34,105.41 52.07,107.95 54.61,110.49 59.69,113.03 66.04,113.03 68.58,114.3 E22.14 | E3.14 106.68,10.16 102.87,11.43 96.52,11.43 92.71,13.97 90.17,16.51 91.44,17.78 95.25,19.05 104.14,21.59 E6.14 106.68,25.4 99.06,27.94 93.98,27.94 90.17,31.75 93.98,34.29 104.14,36.83 106.68,38.1 E9.14 | C3.1 E3.14 | E11.14 106.68,55.88 102.87,57.15 96.52,58.42 91.44,59.69 90.17,62.23 90.17,64.77 93.98,67.31 101.6,67.31 106.68,68.58 E14.14 106.68,71.12 104.14,72.39 96.52,73.66 93.98,73.66 91.44,74.93 90.17,77.47 91.44,80.01 96.52,82.55 102.87,82.55 106.68,83.82 E17.14 106.68,86.36 104.14,87.63 97.79,88.9 93.98,88.9 90.17,92.71 92.71,95.25 99.06,96.52 106.68,99.06 E20.14 106.68,101.6 101.6,104.14 95.25,104.14 92.71,105.41 90.17,107.95 93.98,111.76 104.14,113.03 106.68,114.3 E23.14
  Bottom 0.813: E7.14 C7.1 41.91,50.8 41.91,52.07 39.37,55.88 38.1,58.42 E12.14 | E15.14 40.64,76.2 44.45,72.39 46.99,68.58 C12.1 | E18.14 35.56,93.98 C15.1

### Text on the board
Top: FLIP CHIP | SIDE 1
Bottom: SHIFTER A.C. | M227B